# EAGLE design freBot_V2 (EAGLE 7.3.0)
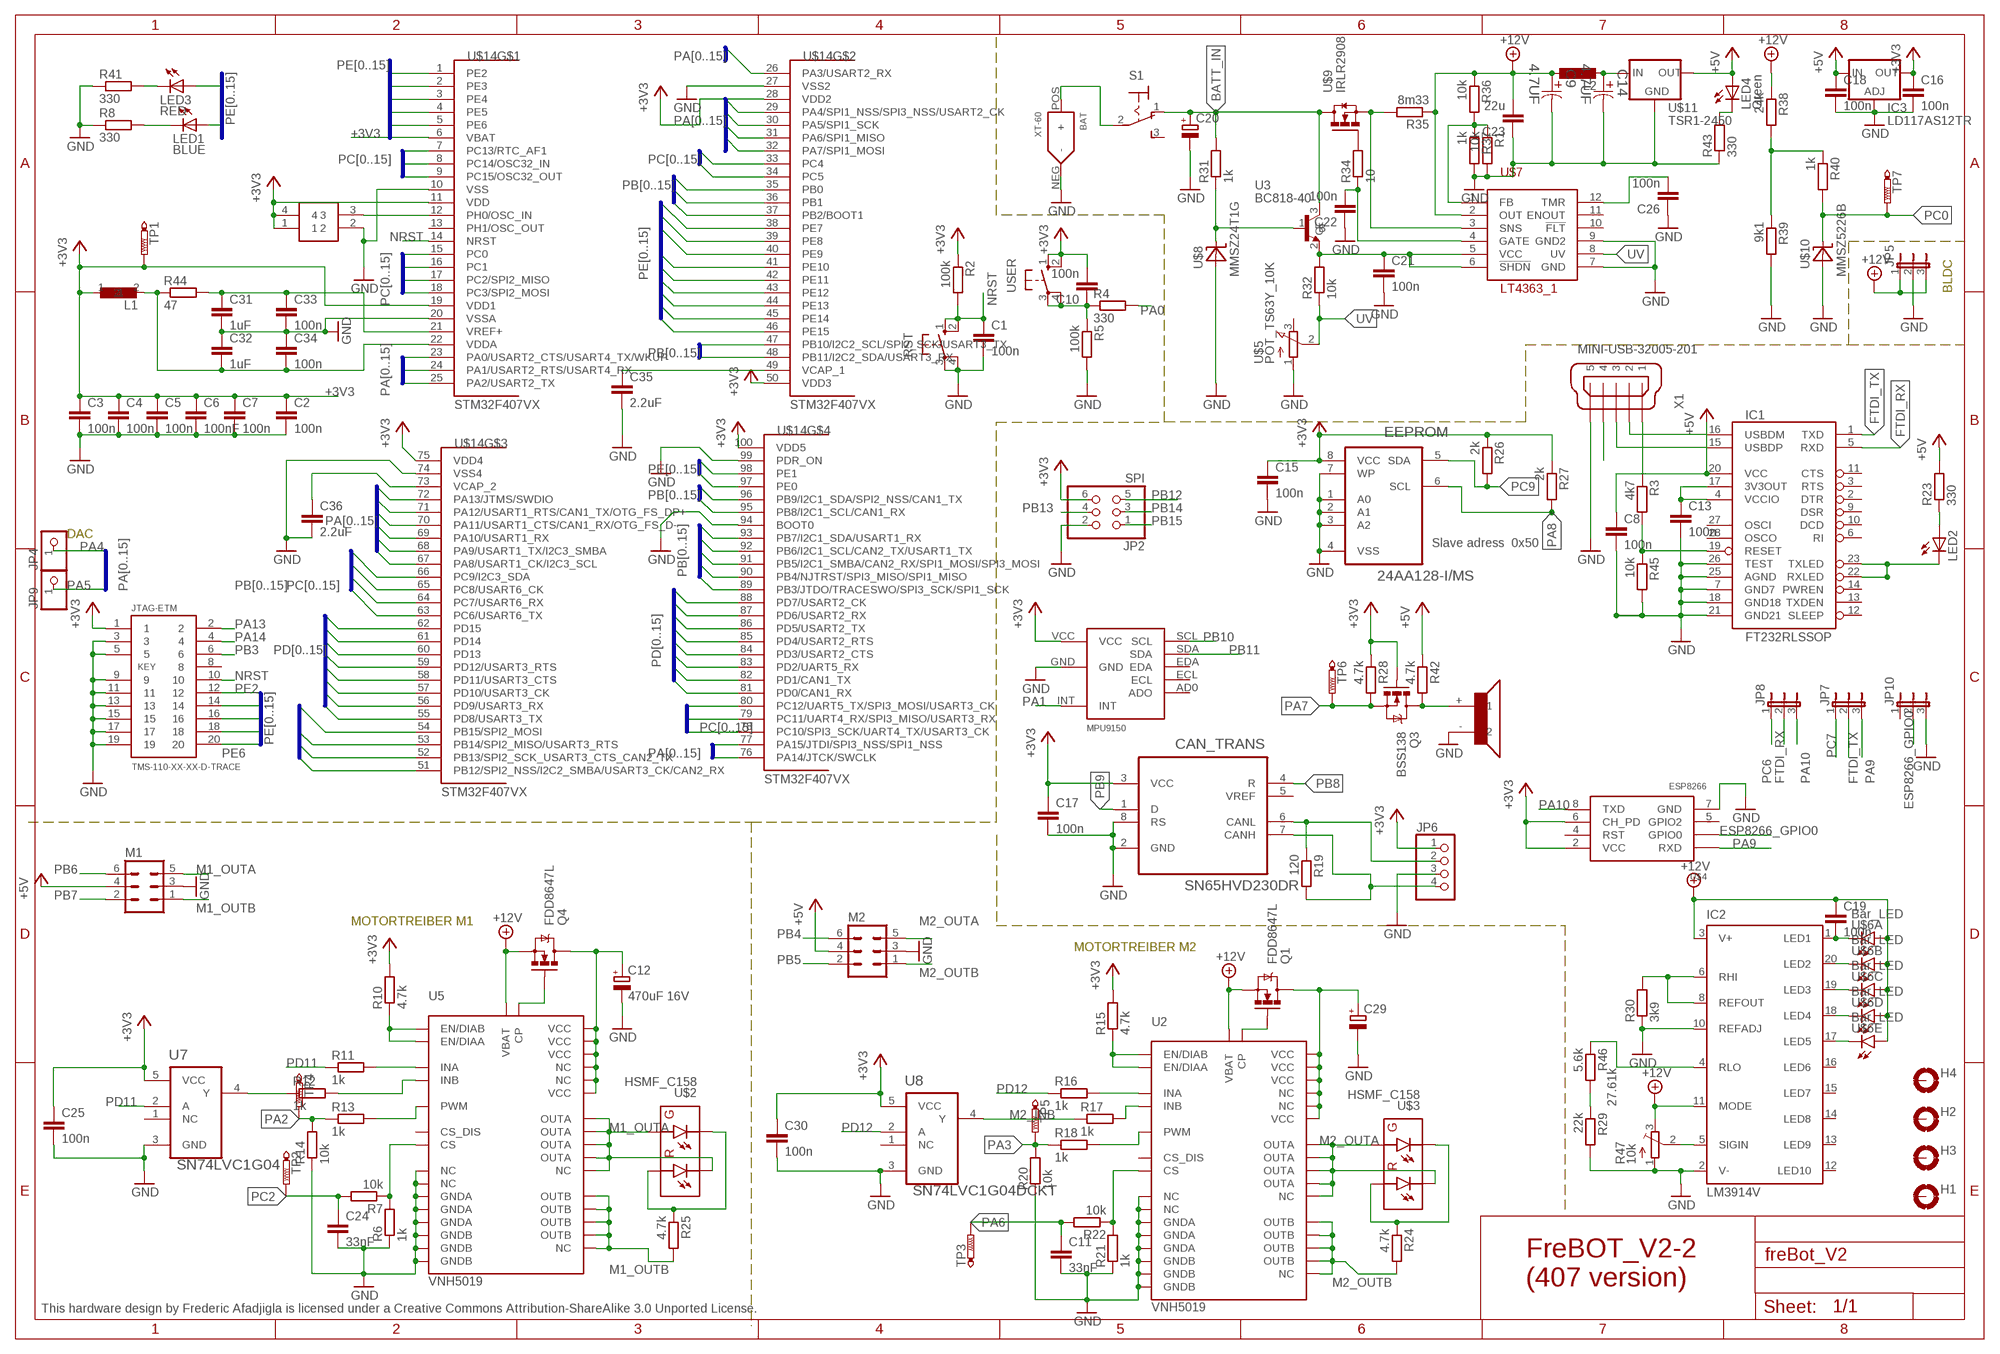
[diagram p0: schematic, sheet 1]

## Parts
BAT  XT-60  [XT-60]
C1  100n  C-EUC0603  [C0603]
C2  100n  C-EUC0603  [C0603]
C3  100n  C-EUC0603  [C0603]
C4  100n  C-EUC0603  [C0603]
C5  100n  C-EUC0603  [C0603]
C6  100nF  C-EUC0603  [C0603]
C7  100n  C-EUC0603  [C0603]
C8  100n  C-EUC0603  [C0603]
C9  4.7UF  EEE-1ES4R7SR-CASE-A  [CAPAE330X560N]
C10  100n  C-EUC0603  [C0603]
C11  33nF  C-EUC0805  [C0805]
C12  470uF 16V  CPOL-EU175TMP-0808  [175TMP-0808]
C13  100n  C-EUC0603  [C0603]
C14  4.7UF  EEE-1ES4R7SR-CASE-A  [CAPAE330X560N]
C15  100n  C-EUC0603  [C0603]
C16  100n  C-EUC0603  [C0603]
C17  100n  C-EUC0603  [C0603]
C18  100n  C-EUC0603  [C0603]
C19  100n  C-EUC0603  [C0603]
C20  CPOL-EU153CLV-0505  [153CLV-0505]
C21  100n  C-EUC0603  [C0603]
C22  100n  C-EUC0805  [C0805]
C23  22u  C-EUC0805  [C0805]
C24  33nF  C-EUC0805  [C0805]
C25  100n  C-EUC0603K  [C0603K]
C26  100n  C-EUC0805  [C0805]
C29  CPOL-EU175TMP-0808  [175TMP-0808]
C30  100n  C-EUC0603K  [C0603K]
C31  1uF  C-EUC0603  [C0603]
C32  1uF  C-EUC0603  [C0603]
C33  100n  C-EUC0603  [C0603]
C34  100n  C-EUC0603  [C0603]
C35  2.2uF  C-EUC0805  [C0805]
C36  2.2uF  C-EUC0805  [C0805]
CAN_TRANS  SN65HVD230DR  [SOIC127P600X175-8N]
EEPROM  24AA128-I/MS  [SOP65P490X110-8N]
H1  MOUNT-PAD-ROUND3.0  [3,0-PAD]
H2  MOUNT-PAD-ROUND3.0  [3,0-PAD]
H3  MOUNT-PAD-ROUND3.0  [3,0-PAD]
H4  MOUNT-PAD-ROUND3.0  [3,0-PAD]
IC1  FT232RLSSOP  [SSOP28DB]
IC2  LM3914V  [PLCC20S]
IC3  LD117AS12TR  [SOT223]
JP2  SPI  PINHD-2X3  [2X03]
JP4  PINHD-1X1  [1X01]
JP5  JP2E  [JP2]
JP6  PINHD-1X4  [1X04]
JP7  JP2E  [JP2]
JP8  JP2E  [JP2]
JP9  PINHD-1X1  [1X01]
JP10  JP2E  [JP2]
JTAG-ETM  TMS-110-XX-XX-D-TRACE  [TMS-110-XX-XX-D-TRACE]
L1  FERRITPERLE_0805  [FERRITPERLE_0805]
L2  L-EUWE-TPC  [POWER-CHOKE_WE-TPC]
LED1  BLUE  LEDCHIP-LED0805  [CHIP-LED0805]
LED2  LEDCHIP-LED0805  [CHIP-LED0805]
LED3  RED  LEDCHIP-LED0805  [CHIP-LED0805]
LED4  Green  LEDCHIP-LED0805  [CHIP-LED0805]
M1  ML6  [ML6]
M2  ML6  [ML6]
MPU9150  MPU9150_BREAKOUT  [MPU9150_BREAKOUT]
Q1  FDD8647L  MOSFET-NCHANNELFDD8580  [DPAK]
Q3  BSS138  MOSFET-NCHANNELBSS138  [SOT23-3]
Q4  FDD8647L  MOSFET-NCHANNELFDD8580  [DPAK]
R1  10k  R-EU_R0603  [R0603]
R2  100k  R-EU_R0603  [R0603]
R3  4k7  R-EU_R0603  [R0603]
R4  330  R-EU_R0603  [R0603]
R5  100k  R-EU_R0603  [R0603]
R6  1k  R-EU_R0603  [R0603]
R7  10k  R-EU_R0603  [R0603]
R8  330  R-EU_R0603  [R0603]
R10  4.7k  R-EU_R0603  [R0603]
R11  1k  R-EU_R0603  [R0603]
R12  1k  R-EU_R0603  [R0603]
R13  1k  R-EU_R0603  [R0603]
R14  10k  R-EU_R0603  [R0603]
R15  4.7k  R-EU_R0603  [R0603]
R16  1k  R-EU_R0603  [R0603]
R17  1k  R-EU_R0603  [R0603]
R18  1k  R-EU_R0603  [R0603]
R19  120  R-EU_R0603  [R0603]
R20  10k  R-EU_R0603  [R0603]
R21  1k  R-EU_R0603  [R0603]
R22  10k  R-EU_R0603  [R0603]
R23  330  R-EU_R0603  [R0603]
R24  4.7k  R-EU_R0603  [R0603]
R25  4.7k  R-EU_R0603  [R0603]
R26  2k  R-EU_R0603  [R0603]
R27  2k  R-EU_R0603  [R0603]
R28  4.7k  R-EU_R0603  [R0603]
R29  22k  R-EU_R0603  [R0603]
R30  3k9  R-EU_R0603  [R0603]
R31  1k  R-EU_R0603  [R0603]
R32  10k  R-EU_R0603  [R0603]
R34  10  R-EU_R0603  [R0603]
R35  8m33  R-EU_R2512  [R2512]
R36  10k  R-EU_R0603  [R0603]
R37  1k  R-EU_R0603  [R0603]
R38  24k  R-EU_R0603  [R0603]
R39  9k1  R-EU_R0603  [R0603]
R40  1k  R-EU_R0603  [R0603]
R41  330  R-EU_R0603  [R0603]
R42  4.7k  R-EU_R0603  [R0603]
R43  330  R-EU_R0603  [R0603]
R44  47  R-EU_R0603  [R0603]
R45  10k  R-EU_R0603  [R0603]
R46  5.6k  R-EU_R0603  [R0603]
R47  10k  TRIM_EU-SM-42/43A  [SM-42/43A]
RST  10-XX  [B3F-10XX]
S1  M9040P  [M9040P]
TP1  PTR1B1,27  [B1,27]
TP2  PTR1B1,27  [B1,27]
TP3  PTR1B1,27  [B1,27]
TP4  PTR1B1,27  [B1,27]
TP5  PTR1B1,27  [B1,27]
TP6  PTR1B1,27  [B1,27]
TP7  PTR1B1,27  [B1,27]
U2  VNH5019  [VNH5019]
U3  BC818-40  [SOT95P240X97-3N]
U5  VNH5019  [VNH5019]
U7  SN74LVC1G04  SN74LVC1G04DCKT  [SOT65P210X110-5N]
U8  SN74LVC1G04DCKT  [SOT65P210X110-5N]
U$1  CB3_OSCILLATOR  [CB3_OSCILLATOR]
U$2  HSMF_C158  [HSMF_C158]
U$3  HSMF_C158  [HSMF_C158]
U$4  ESP8266  [ESP8266]
U$5  POT_TS63Y_10K  [POT_TS63Y_10K]
U$6  Bar_LED  LED_BARGRAPH_5  [LED_BARGRAPH_5]
U$7  LT4363_1  [MSOP12]
U$8  MMSZ24T1G  [SOD123]
U$9  IRLR2908  [DPAK-TO252]
U$10  MMSZ5226B  MMSZ24T1G  [SOD123]
U$11  TSR1-2450  [TSR1-2450]
U$12  BUZZER  [BUZZER]
U$14  STM32F407VX  [LQFP100]
USER  10-XX  [B3F-10XX]
X1  MINI-USB-32005-201  [32005-201]

## Nets
+3V3: C2.1 C3.1 C4.1 C5.1 C6.1 C7.1 C10.2 C15.1 C16.1 C17.1 C25.1 C30.1 CAN_TRANS.3(VCC) EEPROM.8(VCC) IC3.4(OUT) JP2.6 JP6.1 JTAG-ETM.1 L1.1 MPU9150.VCC Q3.1(G) R2.1 R10.2 R15.2 R26.1 R27.1 R28.1 TP1.TP U7.5(VCC) U8.5(VCC) U$1.1 U$1.4 U$4.2(VCC) U$4.6(CH_PD) U$14.6(VBAT) U$14.11(VDD) U$14.19(VDD1) U$14.28(VDD2) U$14.50(VDD3) U$14.75(VDD4) U$14.100(VDD5) USER.1(S) USER.2(S1)
+5V: C8.1 C18.1 IC1.20(VCC) IC3.3(IN) LED4.A M1.4 M2.4 R23.2 R42.1 U$11.3(OUT)
+12V: C9.1 C19.1 C23.2 IC2.3(V+) IC2.11(MODE) JP5.1 JP5.3 L2.1 Q1.3(S) R35.1 R36.1 R38.1 R47.3(E) U2.12(VBAT) U5.12(VBAT) U$6.1(A:A) U$6.2(B:A) U$6.3(C:A) U$6.4(D:A) U$6.5(E:A) U$7.2(OUT)
BATT_IN: C20.+ R31.2 S1.1(O) U3.3(C) U$9.4(D)
ESP8266_GPIO0: JP10.2 U$4.3(GPIO0)
FTDI_RX: IC1.5(RXD) JP8.2
FTDI_TX: IC1.1(TXD) JP7.2
GND: BAT.NEG(-) C1.2 C2.2 C3.2 C4.2 C5.2 C6.2 C7.2 C8.2 C9.2 C11.2 C12.- C13.2 C14.2 C15.2 C16.2 C17.2 C18.2 C20.- C21.2 C22.1 C23.1 C24.2 C25.2 C26.1 C29.- C30.2 C31.2 C32.1 C33.2 C34.1 C35.2 C36.2 CAN_TRANS.2(GND) CAN_TRANS.8(RS) EEPROM.1(A0) EEPROM.2(A1) EEPROM.3(A2) EEPROM.4(VSS) EEPROM.7(WP) IC1.7(GND7) IC1.18(GND18) IC1.21(GND21) IC1.25(AGND) IC1.26(TEST) IC2.2(V-) IC2.10(REFADJ) IC3.1(ADJ) JP2.2 JP5.2 JP6.3 JP10.3 JTAG-ETM.3 JTAG-ETM.5 JTAG-ETM.9 JTAG-ETM.11 JTAG-ETM.13 JTAG-ETM.15 JTAG-ETM.17 JTAG-ETM.19 M1.3 M2.3 MPU9150.GND R1.2 R5.2 R6.1 R8.1 R14.1 R20.1 R21.1 R29.2 R30.1 R37.2 R39.2 R41.1 R43.1 R45.2 R47.1(A) RST.3(P) RST.4(P1) U2.17(NC) U2.18(GNDB) U2.19(GNDB) U2.20(GNDB) U2.26(GNDA) U2.27(GNDA) U2.28(GNDA) U2.29(NC) U5.17(NC) U5.18(GNDB) U5.19(GNDB) U5.20(GNDB) U5.26(GNDA) U5.27(GNDA) U5.28(GNDA) U5.29(NC) U7.3(GND) U8.3(GND) U$1.2 U$4.7(GND) U$5.1(A) U$7.7(GND) U$7.9(GND2) U$8.A U$10.A U$11.2(GND) U$12.- U$14.10(VSS) U$14.20(VSSA) U$14.27(VSS2) U$14.74(VSS4) U$14.94(BOOT0) U$14.99(PDR_ON) X1.5
M1_INB: R12.1 U7.4(Y)
M1_OUTA: M1.5 U5.1(OUTA) U5.24(NC) U5.25(OUTA) U5.30(OUTA) U5.SLUG2(OUTA) U$2.GA U$2.RC
M1_OUTB: M1.1 R25.2 U5.15(OUTB) U5.16(OUTB) U5.21(OUTB) U5.22(NC) U5.SLUG3(OUTB)
M2_INB: R17.1 U8.4(Y)
M2_OUTA: M2.5 U2.1(OUTA) U2.24(NC) U2.25(OUTA) U2.30(OUTA) U2.SLUG2(OUTA) U$3.GA U$3.RC
M2_OUTB: M2.1 R24.2 U2.15(OUTB) U2.16(OUTB) U2.21(OUTB) U2.22(NC) U2.SLUG3(OUTB)
N$1: R12.2 U5.10(INB)
N$2: C31.1 C33.1 R44.2 U$14.21(VREF+)
N$3: U$1.3 U$14.12(PH0/OSC_IN)
N$4: X1.4
N$5: IC1.19(RESET) R3.2 R45.1
N$6: R6.2 R7.1 U5.8(CS)
N$7: C29.+ Q1.4(D) U2.2(NC) U2.3(VCC) U2.13(VCC) U2.14(NC) U2.23(VCC) U2.SLUG1(VCC)
N$8: R15.1 U2.5(EN/DIAA) U2.9(EN/DIAB)
N$9: R10.1 U5.5(EN/DIAA) U5.9(EN/DIAB)
N$10: R11.2 U5.4(INA)
N$11: C12.+ Q4.4(D) U5.2(NC) U5.3(VCC) U5.13(VCC) U5.14(NC) U5.23(VCC) U5.SLUG1(VCC)
N$12: R16.2 U2.4(INA)
N$13: Q4.1(G) U5.11(CP)
N$14: R13.2 U5.7(PWM)
N$15: R18.2 U2.7(PWM)
N$16: R17.2 U2.10(INB)
N$17: IC2.4(RLO) R46.1
N$18: CAN_TRANS.6(CANL) JP6.2 R19.1
N$19: R21.2 R22.1 U2.8(CS)
N$20: R29.1 R46.2
N$22: C13.1 IC1.4(VCCIO) IC1.17(3V3OUT)
N$23: C14.1 L2.2 U$11.1(IN)
N$24: Q1.1(G) U2.11(CP)
N$25: LED1.C R8.2
N$26: IC1.22(RXLED) IC1.23(TXLED) LED2.C
N$28: IC1.15(USBDP) X1.3
N$30: BAT.POS(+) S1.2(P)
N$31: LED2.A R23.1
N$32: R24.1 U$3.GC U$3.RA
N$34: Q3.3(D) R42.2 U$12.+
N$35: IC2.5(SIGIN) R47.2(S)
N$36: C10.1 R4.1 R5.1 USER.3(P) USER.4(P1)
N$37: LED3.C R41.2
N$38: R25.1 U$2.GC U$2.RA
N$40: C19.2 IC2.1(LED1) U$6.10(A:C)
N$41: IC2.6(RHI) IC2.8(REFOUT) R30.2
N$42: IC2.20(LED2) U$6.9(B:C)
N$43: IC2.19(LED3) U$6.8(C:C)
N$44: IC2.18(LED4) U$6.7(D:C)
N$45: IC2.17(LED5) U$6.6(E:C)
N$46: R31.1 U3.1(B) U$8.C
N$47: R34.2 U$9.1(G)
N$48: C21.1 R32.2 U3.2(E) U$7.5(VCC) U$7.6(!SHDN)
N$49: C22.2 R34.1 U$7.4(GATE)
N$50: R35.2 U$7.3(SNS) U$9.3(S)
N$51: C26.2 U$7.12(TMR)
N$52: R1.1 R36.2 R37.1 U$7.1(FB)
N$53: C32.2 C34.2 L1.2 R44.1 U$14.22(VDDA)
N$54: R38.2 R39.1 R40.1
N$58: LED4.C R43.2
N$59: C35.1 U$14.49(VCAP_1)
N$61: CAN_TRANS.7(CANH) JP6.4 R19.2
N$64: IC1.16(USBDM) X1.2
N$66: C36.1 U$14.73(VCAP_2)
NRST: C1.1 JTAG-ETM.10 R2.2 RST.1(S) RST.2(S1) U$14.14(NRST)
PA0: R4.2 U$14.23(PA0/USART2_CTS/USART4_TX/WKUP)
PA1: MPU9150.INT U$14.24(PA1/USART2_RTS/USART4_RX)
PA2: R13.1 R14.2 TP4.TP U$14.25(PA2/USART2_TX)
PA3: R18.1 R20.2 TP5.TP U$14.26(PA3/USART2_RX)
PA4: JP4.1 U$14.29(PA4/SPI1_NSS/SPI3_NSS/USART2_CK)
PA5: JP9.1 U$14.30(PA5/SPI1_SCK)
PA6: C11.1 R22.2 TP3.TP U$14.31(PA6/SPI1_MISO)
PA7: Q3.2(S) R28.2 TP6.TP U$14.32(PA7/SPI1_MOSI)
PA8: EEPROM.6(SCL) R27.2 U$14.67(PA8/USART1_CK/I2C3_SCL)
PA9: JP7.3 U$4.1(RXD) U$14.68(PA9/USART1_TX/I2C3_SMBA)
PA10: JP8.3 U$4.8(TXD) U$14.69(PA10/USART1_RX)
PA11: U$14.70(PA11/USART1_CTS/CAN1_RX/OTG_FS_D-)
PA12: U$14.71(PA12/USART1_RTS/CAN1_TX/OTG_FS_DP+)
PA13: JTAG-ETM.2 U$14.72(PA13/JTMS/SWDIO)
PA14: JTAG-ETM.4 U$14.76(PA14/JTCK/SWCLK)
PA15: U$14.77(PA15/JTDI/SPI3_NSS/SPI1_NSS)
PB0: U$14.35(PB0)
PB1: U$14.36(PB1)
PB2: U$14.37(PB2/BOOT1)
PB3: JTAG-ETM.6 U$14.89(PB3/JTDO/TRACESWO/SPI3_SCK/SPI1_SCK)
PB4: M2.6 U$14.90(PB4/NJTRST/SPI3_MISO/SPI1_MISO)
PB5: M2.2 U$14.91(PB5/I2C1_SMBA/CAN2_RX/SPI1_MOSI/SPI3_MOSI)
PB6: M1.6 U$14.92(PB6/I2C1_SCL/CAN2_TX/USART1_TX)
PB7: M1.2 U$14.93(PB7/I2C1_SDA/USART1_RX)
PB8: CAN_TRANS.4(R) U$14.95(PB8/I2C1_SCL/CAN1_RX)
PB9: CAN_TRANS.1(D) U$14.96(PB9/I2C1_SDA/SPI2_NSS/CAN1_TX)
PB10: MPU9150.SCL U$14.47(PB10/I2C2_SCL/SPI2_SCK/USART3_TX)
PB11: MPU9150.SDA U$14.48(PB11/I2C2_SDA/USART3_RX)
PB12: JP2.5 U$14.51(PB12/SPI2_NSS/I2C2_SMBA/USART3_CK/CAN2_RX)
PB13: JP2.4 U$14.52(PB13/SPI2_SCK_USART3_CTS_CAN2_TX)
PB14: JP2.3 U$14.53(PB14/SPI2_MISO/USART3_RTS)
PB15: JP2.1 U$14.54(PB15/SPI2_MOSI)
PC0: R40.2 TP7.TP U$10.C U$14.15(PC0)
PC1: U$14.16(PC1)
PC2: C24.1 R7.2 TP2.TP U$14.17(PC2/SPI2_MISO)
PC3: U$14.18(PC3/SPI2_MOSI)
PC4: U$14.33(PC4)
PC5: U$14.34(PC5)
PC6: JP8.1 U$14.63(PC6/USART6_TX)
PC7: JP7.1 U$14.64(PC7/USART6_RX)
PC8: U$14.65(PC8/USART6_CK)
PC9: EEPROM.5(SDA) R26.2 U$14.66(PC9/I2C3_SDA)
PC10: U$14.78(PC10/SPI3_SCK/UART4_TX/USART3_CK)
PC11: U$14.79(PC11/UART4_RX/SPI3_MISO/USART3_RX)
PC12: U$14.80(PC12/UART5_TX/SPI3_MOSI/USART3_CK)
PC13: U$14.7(PC13/RTC_AF1)
PC14: U$14.8(PC14/OSC32_IN)
PC15: U$14.9(PC15/OSC32_OUT)
PD0: U$14.81(PD0/CAN1_RX)
PD1: U$14.82(PD1/CAN1_TX)
PD2: U$14.83(PD2/UART5_RX)
PD3: U$14.84(PD3/USART2_CTS)
PD4: U$14.85(PD4/USART2_RTS)
PD5: U$14.86(PD5/USART2_TX)
PD6: U$14.87(PD6/USART2_RX)
PD7: U$14.88(PD7/USART2_CK)
PD8: U$14.55(PD8/USART3_TX)
PD9: U$14.56(PD9/USART3_RX)
PD10: U$14.57(PD10/USART3_CK)
PD11: R11.1 U7.2(A) U$14.58(PD11/USART3_CTS)
PD12: R16.1 U8.2(A) U$14.59(PD12/USART3_RTS)
PD13: U$14.60(PD13)
PD14: U$14.61(PD14)
PD15: U$14.62(PD15)
PE0: LED3.A U$14.97(PE0)
PE1: LED1.A U$14.98(PE1)
PE2: JTAG-ETM.12 U$14.1(PE2)
PE3: JTAG-ETM.14 U$14.2(PE3)
PE4: JTAG-ETM.16 U$14.3(PE4)
PE5: JTAG-ETM.18 U$14.4(PE5)
PE6: JTAG-ETM.20 U$14.5(PE6)
PE7: U$14.38(PE7)
PE8: U$14.39(PE8)
PE9: U$14.40(PE9)
PE10: U$14.41(PE10)
PE11: U$14.42(PE11)
PE12: U$14.43(PE12)
PE13: U$14.44(PE13)
PE14: U$14.45(PE14)
PE15: U$14.46(PE15)
USB_5V: R3.1 X1.1
UV: R32.1 U$5.2(S) U$7.8(UV)
Unconnected: CAN_TRANS.5(VREF) H1.B3,0(MOUNT) H2.B3,0(MOUNT) H3.B3,0(MOUNT) H4.B3,0(MOUNT) IC1.2(DTR) IC1.3(RTS) IC1.6(RI) IC1.9(DSR) IC1.10(DCD) IC1.11(CTS) IC1.12(SLEEP) IC1.13(TXDEN) IC1.14(PWREN) IC1.27(OSCI) IC1.28(OSCO) IC2.12(LED10) IC2.13(LED9) IC2.14(LED8) IC2.15(LED7) IC2.16(LED6) JP10.1 JTAG-ETM.8 MPU9150.AD0(ADO) MPU9150.ECL MPU9150.EDA Q4.3(S) S1.3(S) U2.6(CS_DIS) U5.6(CS_DIS) U7.1(NC) U8.1(NC) U$4.4(RST) U$4.5(GPIO2) U$5.3(E) U$7.10(!FLT) U$7.11(ENOUT) U$14.13(PH1/OSC_OUT)

## Buses
PE[0..15]
PA[0..15]
PC[0..15]
PD[0..15]
PB[0..15]

## Notes on the sheet
- BLDC
- DAC | Slave adress  0x50
- FTDI
- FTDI
- MOTORTREIBER M1
- MOTORTREIBER M2
- 27.61k
- FreBOT_V2-2
  (407 version)
- This hardware design by Frederic Afadjigla is licensed under a Creative Commons Attribution-ShareAlike 3.0 Unported License.

## Library data of the parts
BAT = freBotLib:XT-60
C1-C8 C10 C11 C13 C15-C19 C21-C26 C30-C36 = rcl:C-EU: CAPACITOR, European symbol
C9 C14 = Panasonic-EEE0_EEE1_EEE2_EEEFC:EEE-: Aluminum Electrolytic Capacitors,Surface Mount Type; MPN: EEE-1ES4R7SR; OC_FARNELL: 2284806; OC_NEWARK: 53W3806; PACKAGE: CASE-A; SUPPLIER: PANASONIC; TOLERANCE: 20%; VOLTAGERATING: 25V
C12 C20 C29 = rcl:CPOL-EU: POLARIZED CAPACITOR, European symbol
CAN_TRANS = SN65HVD230D:SN65HVD230DR: 3.3-V CAN TRANSCEIVERS; MPN: SN65HVD230DR; OC_FARNELL: 8452148; OC_NEWARK: 75C7745; PACKAGE: SOIC-8; SUPPLIER: Texas Instruments
EEPROM = freBotLib:24AA128-I/MS
H1-H4 = holes:MOUNT-PAD-ROUND: MOUNTING PAD, round
IC1 = SparkFun:FT232RL: USB UART FT232RL 4th Generation USB UART (USB <-> Serial) Controller. Spark Fun Electronics SKU : COM-00650
IC2 = national-semiconductor:LM391: Dot/Bar Display Driver Source: Data sheet LM3915 <http://www.national.com/ds/LM/LM3915.pdf> Data sheet LM3914 <http://www.national.com/ds/LM/LM3914.pdf>
IC3 = v-reg:LD117A?*: Low drop fixed and adjustable positive voltage regulators 1 A Source: http://www.st.com/stonline/products/literature/ds/7194/ld1117axx.pdf
JP2 = pinhead:PINHD-2X3: PIN HEADER
JP4 JP9 = pinhead:PINHD-1X1: PIN HEADER
JP5 JP7 JP8 JP10 = jumper:JP2E: JUMPER
JP6 = pinhead:PINHD-1X4: PIN HEADER
JTAG-ETM = TMS110XXXXDplusTraceJTAG:TMS-110-XX-XX-D-TRACE
L1 = Ferritperle_0805:FERRITPERLE_0805
L2 = rcl:L-EU: INDUCTOR, European symbol
LED1-LED4 = led:LED: LED OSRAM: - CHIPLED LG R971, LG N971, LY N971, LG Q971, LY Q971, LO R971, LY R971 LH N974, LH R974 LS Q976, LO Q976, LY Q976 LO Q996 - Hyper CHIPLED LW Q18S LB Q993, LB Q99A, LB R99A - SideLED LS A670, LO A670, LY A670, LG A670, LP A670 LB A673, LV A673, LT A673, LW A673 LH A674 LY A675 LS A676, LA A676, LO A676, LY A676, LW A676 LS A679, LY A679, LG A679 - Hyper Micro SIDELED® LS Y876, LA Y876, LO Y876, LY Y876 LT Y87S - SmartLED LW L88C, LW L88S LB L89C, LB L89S, LG L890 LS L89K, LO L89K, LY L89K LS L896, LA L896, LO L896, LY L896 - TOPLED LS T670, LO T670, LY T670, LG T670, LP T670 LSG T670, LSP T670, LSY T670, LOP T670, LYG T670 LG T671, LOG T671, LSG T671 LB T673, LV T673, LT T673, LW T673 LH T674 LS T676, LA T676, LO T676, LY T676, LB T676, LH T676, LSB T676, LW T676 LB T67C, LV T67C, LT T67C, LS T67K, LO T67K, LY T67K, LW E67C LS E67B, LA E67B, LO E67B, LY E67B, LB E67C, LV E67C, LT E67C LW T67C LS T679, LY T679, LG T679 LS T770, LO T770, LY T770, LG T770, LP T770 LB T773, LV T773, LT T773, LW T773 LH T774 LS E675, LA E675, LY E675, LS T675 LS T776, LA T776, LO T776, LY T776, LB T776 LHGB T686 LT T68C, LB T68C - Hyper Mini TOPLED® LB M676 - Mini TOPLED Santana® LG M470 LS M47K, LO M47K, LY M47K Source: http://www.osram.convergy.de LUXEON: - LUMILED® LXK2-PW12-R00, LXK2-PW12-S00, LXK2-PW14-U00, LXK2-PW14-V00 LXK2-PM12-R00, LXK2-PM12-S00, LXK2-PM14-U00 LXK2-PE12-Q00, LXK2-PE12-R00, LXK2-PE12-S00, LXK2-PE14-T00, LXK2-PE14-U00 LXK2-PB12-K00, LXK2-PB12-L00, LXK2-PB12-M00, LXK2-PB14-N00, LXK2-PB14-P00, LXK2-PB14-Q00 LXK2-PR12-L00, LXK2-PR12-M00, LXK2-PR14-Q00, LXK2-PR14-R00 LXK2-PD12-Q00, LXK2-PD12-R00, LXK2-PD12-S00 LXK2-PH12-R00, LXK2-PH12-S00 LXK2-PL12-P00, LXK2-PL12-Q00, LXK2-PL12-R00 Source: www.luxeon.com KINGBRIGHT: KA-3528ASYC Source: www.kingbright.com
M1 M2 = con-harting-ml:ML6: HARTING; OC_FARNELL: unknown; OC_NEWARK: unknown
MPU9150 = freBotLib:MPU9150_BREAKOUT
Q1 Q4 = SparkFun:MOSFET-NCHANNEL
Q3 = SparkFun-DiscreteSemi:MOSFET-NCHANNEL: Common NMOSFET Parts MFG P/N Store ID Prod ID FDD8780 TRANS-09984 SI7820DN TRANS-11055 FDS6630A IC-08089 2N7002PW TRANS-11151 FQP30N06L COM-10213 TRANS-10060 BSS123LT1G TRANS-08345 BSS138 TRANS-00830 BS170 2N7000; PROD_ID: TRANS-00830; VALUE: 200mA/50V
R1-R8 R10-R32 R34-R46 = rcl:R-EU_: RESISTOR, European symbol
R47 = pot:TRIM_EU-: POTENTIOMETER
RST USER = switch-omron:10-XX: OMRON SWITCH; MPN: B3F-1000; OC_FARNELL: 176432; OC_NEWARK: 36M3542
S1 = switch:M9040P: TOGGLE SWITCH Marquardt
TP1-TP7 = testpad:PTR1: TEST PIN
U2 U5 = SparkFun:VNH5019
U3 = freBotLib:BC818-40: NPN Epitaxial Silicon Transistor; MPN: BC818-40; OC_FARNELL: 9846662; OC_NEWARK: 96K6864; PACKAGE: SOT-3; SUPPLIER: Fairchild
U7 U8 = freBotLib:SN74LVC1G04DCKT: SINGLE INVERTER GATE; MPN: SN74LVC1G04DCKT; OC_FARNELL: 1470831; OC_NEWARK: 22H0375; PACKAGE: SC-70-5; SUPPLIER: Texas Instruments
U$1 = CB3_oscillator:CB3_OSCILLATOR
U$2 U$3 = freBotLib:HSMF_C158
U$4 = freBotLib:ESP8266
U$5 = FSEWeatherShield:POT_TS63Y_10K
U$6 = freBotLib:LED_BARGRAPH_5
U$7 = freBotLib:LT4363_1
U$8 U$10 = freBotLib:MMSZ24T1G
U$9 = freBotLib:IRLR2908
U$11 = freBotLib:TSR1-2450
U$12 = freBotLib:BUZZER
U$14 = STM32F407VxLQFP100:STM32F407VX: STmicroelectronics Cortex M4 Series Typ: STM32F407Vx LQFP100
X1 = con-cypressindustries:MINI-USB-: MINI USB-B Conector Source: www.cypressindustries.com; OC_FARNELL: unknown; OC_NEWARK: unknown

## Board
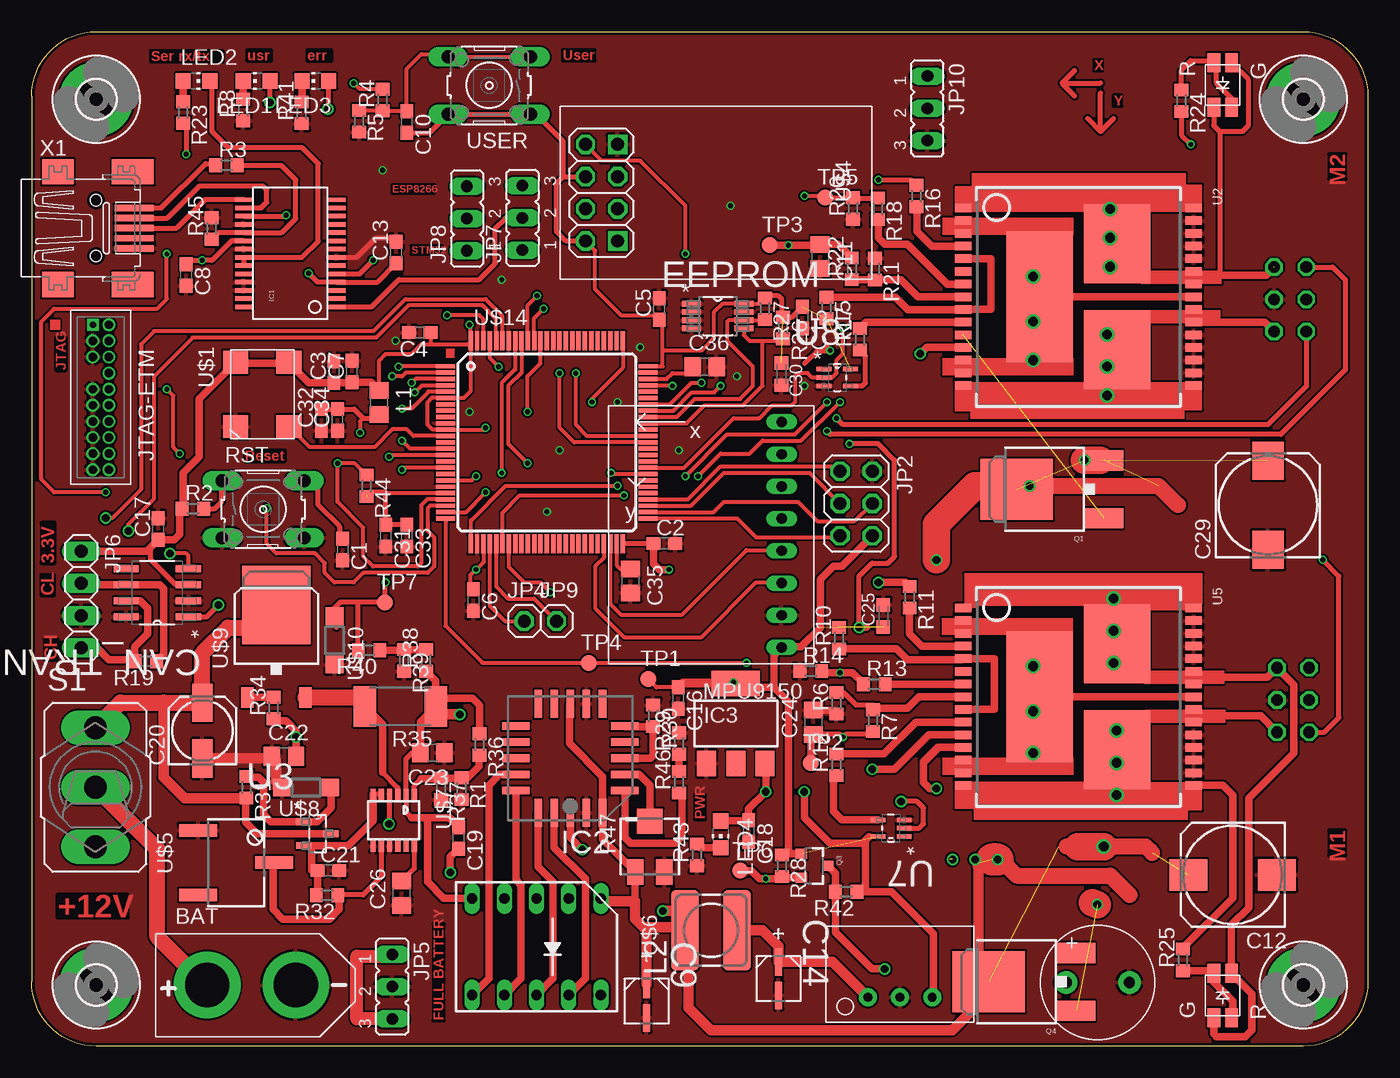
[diagram p1: board, top side]
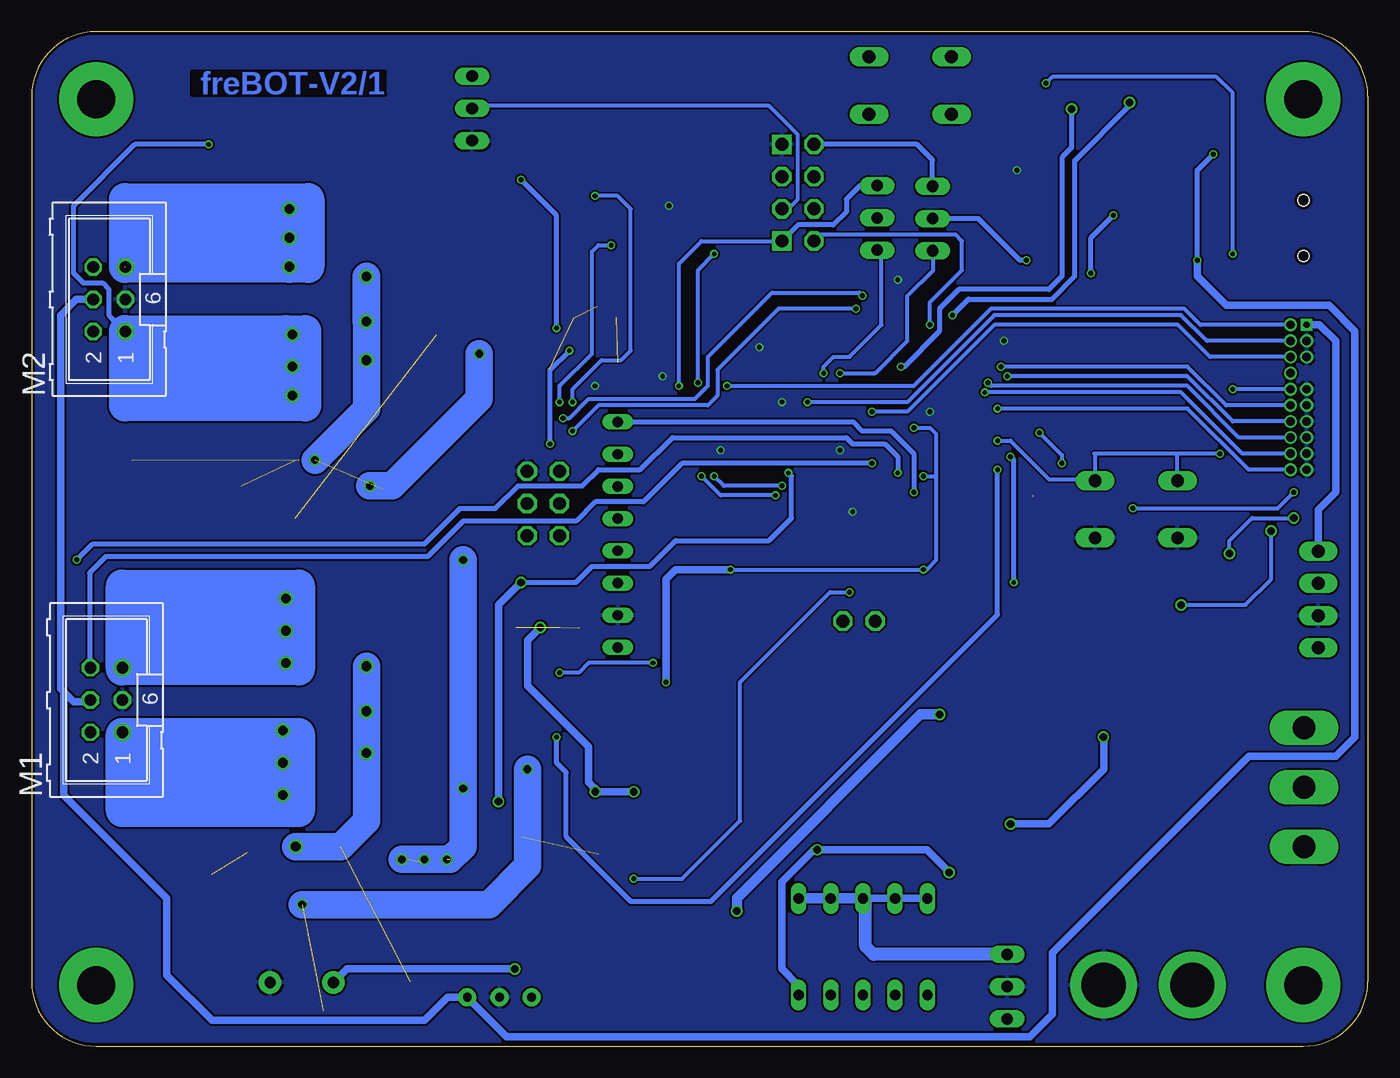
[diagram p2: board, bottom side, seen from below]

Size 105.41 x 80.01 mm. Coordinates in mm from the lower left corner, seen from the top.
Outline: 5.08,80.01 100.33,80.01 arc-90 105.41,74.93 105.41,5.08 arc-90 100.33,0 5.08,0 arc-90 0,5.08 0,74.93 arc-90 5.08,80.01
Copper layers (1*16): Top 0.018mm / dielectric 1.55mm / Bottom 0.018mm
Design rules "eC_2Layer_PClass6_BaseCopperO18_eCDefault": minimum track width 0.15mm, minimum drill 0.35mm, track to track 0.15mm, track to pad 0.15mm, pad to pad 0.15mm, via to via 0.15mm, smd to smd 0mil, copper to edge 0.25mm, drill to drill 0.35mm, minimum pad ring 0.175mm, minimum via ring 0.125mm, stop-mask expansion 0mil, vias tented up to drill 0.45mm, thermal gap 0.2mm

### Footprints (pad centres in the part's own frame; a part is rotated, then mirrored left to right if it is on the bottom)
XT-60 = drill 3.5: NEG 3.19,0; POS -3.81,0
C0603 = smd 1.1 x 1: 1 -0.85,0; 2 0.85,0
CAPAE330X560N = smd 2.159 x 0.559: 1 -1.321,0; 2 1.321,0
C0805 = smd 1.3 x 1.5: 1 -0.95,0; 2 0.95,0
175TMP-0808 = smd 3 x 2.5: + 3.5,0; - -3.5,0
153CLV-0505 = smd 3 x 1.6: + 2.2,0; - -2.2,0
C0603K = smd 1.05 x 1.08: 1 -0.875,0; 2 0.875,0
SOIC127P600X175-8N = smd 1.981 x 0.559: 1 -2.464,1.905; 2 -2.464,0.635; 3 -2.464,-0.635; 4 -2.464,-1.905; 5 2.464,-1.905; 6 2.464,-0.635; 7 2.464,0.635; 8 2.464,1.905
SOP65P490X110-8N = smd 1.499 x 0.457: 1 -2.057,0.965; 2 -2.057,0.33; 3 -2.057,-0.33; 4 -2.057,-0.965; 5 2.057,-0.965; 6 2.057,-0.33; 7 2.057,0.33; 8 2.057,0.965
3,0-PAD = drill 3 pad 5.842: B3,0 0,0
SSOP28DB = smd 0.348 x 1.397: 1 -4.225,-3.656; 2 -3.575,-3.656; 3 -2.925,-3.656; 4 -2.275,-3.656; 5 -1.625,-3.656; 6 -0.975,-3.656; 7 -0.325,-3.656; 8 0.325,-3.656; 9 0.975,-3.656; 10 1.625,-3.656; 11 2.275,-3.656; 12 2.925,-3.656; 13 3.575,-3.656; 14 4.225,-3.656; 15 4.225,3.656; 16 3.575,3.656; 17 2.925,3.656; 18 2.275,3.656; 19 1.625,3.656; 20 0.975,3.656; 21 0.325,3.656; 22 -0.325,3.656; 23 -0.975,3.656; 24 -1.625,3.656; 25 -2.275,3.656; 26 -2.925,3.656; 27 -3.575,3.656; 28 -4.225,3.656
PLCC20S = smd 0.6 x 2.2: 1 0,4.3; 2 -1.27,4.3; 3 -2.54,4.3; 9 -2.54,-4.3; 10 -1.27,-4.3; 11 0,-4.3; 12 1.27,-4.3; 13 2.54,-4.3; 19 2.54,4.3; 20 1.27,4.3 | smd 2.2 x 0.6: 4 -4.3,2.54; 5 -4.3,1.27; 6 -4.3,0; 7 -4.3,-1.27; 8 -4.3,-2.54; 14 4.3,-2.54; 15 4.3,-1.27; 16 4.3,0; 17 4.3,1.27; 18 4.3,2.54
SOT223 = smd 1.5 x 2: 1 -2.3,-3.15; 2 0,-3.15; 3 2.3,-3.15 | smd 3.8 x 2: 4 0,3.15
2X03 = drill 1.016 octagon: 1 -2.54,-1.27; 2 -2.54,1.27; 3 0,-1.27; 4 0,1.27; 5 2.54,-1.27; 6 2.54,1.27
1X01 = drill 1.016 octagon: 1 0,0
JP2 = drill 0.914 long: 1 -2.54,0; 2 0,0; 3 2.54,0
1X04 = drill 1.016 long: 1 -3.81,0; 2 -1.27,0; 3 1.27,0; 4 3.81,0
TMS-110-XX-XX-D-TRACE = drill 0.5 pad 0.914 square: 1 -5.715,0 | drill 0.66 pad 0.813: 2 -5.715,1.27 | drill 0.66 pad 0.914: 3 -4.445,0; 4 -4.445,1.27; 5 -3.175,0; 6 -3.175,1.27; 8 -1.905,1.27; 9 -0.635,0; 10 -0.635,1.27; 11 0.635,0; 12 0.635,1.27; 13 1.905,0; 14 1.905,1.27; 15 3.175,0; 16 3.175,1.27; 17 4.445,0; 18 4.445,1.27; 19 5.715,0; 20 5.715,1.27
FERRITPERLE_0805 = smd 1.3 x 1.5: 1 -0.95,0; 2 0.95,0
POWER-CHOKE_WE-TPC = smd 6.3 x 2.2: 1 0,2.05; 2 0,-2.05
CHIP-LED0805 = smd 1.2 x 1.2: A 0,-1.05; C 0,1.05
ML6 = drill 0.914 octagon: 1 -2.54,-1.27; 2 -2.54,1.27; 3 0,-1.27; 4 0,1.27; 5 2.54,-1.27; 6 2.54,1.27
MPU9150_BREAKOUT = drill 0.813 long: AD0 2.54,3.81; ECL 2.54,6.35; EDA 2.54,8.89; GND 2.54,16.51; INT 2.54,1.27; SCL 2.54,13.97; SDA 2.54,11.43; VCC 2.54,19.05
DPAK = smd 1.6 x 3: 1 -2.28,-5.31; 3 2.28,-5.31 | smd 4.826 x 5.715: 4 0,1.588
SOT23-3 = smd 0.8 x 0.9: 1 -0.95,-1; 2 0.95,-1; 3 0,1.1
R0603 = smd 1 x 1.1: 1 -0.85,0; 2 0.85,0
R2512 = smd 1.8 x 3.2: 1 -2.8,0; 2 2.8,0
SM-42/43A = smd 2 x 1.3: 1 2,1.15; 3 2,-1.15 | smd 2 x 2: 2 -2,0
B3F-10XX = drill 1.016 long: 1 -3.251,2.261; 2 3.251,2.261; 3 -3.251,-2.261; 4 3.251,-2.261
M9040P = drill 1.803 long: 1 0,4.699; 2 0,0; 3 0,-4.699
B1,27 = smd 1.27 x 1.27: TP 0,0
VNH5019 = smd 0.67 x 1.3: 1 -7,-9.1; 2 -6,-9.1; 3 -5,-9.1; 4 -4,-9.1; 5 -3,-9.1; 6 -2,-9.1; 7 -1,-9.1; 8 0,-9.1; 9 1,-9.1; 10 2,-9.1; 11 3,-9.1; 12 4,-9.1; 13 5,-9.1; 14 6,-9.1; 15 7,-9.1; 16 7,9.1; 17 6,9.1; 18 5,9.1; 19 4,9.1; 20 3,9.1; 21 2,9.1; 22 1,9.1; 23 0,9.1; 24 -1,9.1; 25 -2,9.1; 26 -3,9.1; 27 -4,9.1; 28 -5,9.1; 29 -6,9.1; 30 -7,9.1 | smd 10.3 x 5.25: SLUG1 0,-3.05 | smd 6.23 x 5.25: SLUG2 -4.165,3.05; SLUG3 4.165,3.05
SOT95P240X97-3N = smd 1.219 x 0.533: 1 -1.067,0.94; 2 -1.067,-0.94; 3 1.067,0
SOT65P210X110-5N = smd 1.168 x 0.356: 1 -1.041,0.66; 2 -1.041,0; 3 -1.041,-0.66; 4 1.041,-0.66; 5 1.041,0.66
CB3_OSCILLATOR = smd 1.8 x 2: 1 -2.54,-2.1; 2 2.54,-2.1; 3 2.54,2.1; 4 -2.54,2.1
HSMF_C158 = smd 1.5 x 1: GA -1.75,0.7; GC 1.75,0.7; RA -1.75,-0.7; RC 1.75,-0.7
ESP8266 = drill 1.016 square: 1 -1.27,3.81; 7 -1.27,-3.81 | drill 1.016 octagon: 2 1.27,3.81; 3 -1.27,1.27; 4 1.27,1.27; 5 -1.27,-1.27; 6 1.27,-1.27; 8 1.27,-3.81
POT_TS63Y_10K = smd 3 x 1: 1 3,-2.54; 2 -3,0; 3 3,2.54
LED_BARGRAPH_5 = drill 0.813 long: 1 -3.81,-3.81; 2 -1.27,-3.81; 3 1.27,-3.81; 4 3.81,-3.81; 5 6.35,-3.81; 6 6.35,3.81; 7 3.81,3.81; 8 1.27,3.81; 9 -1.27,3.81; 10 -3.81,3.81
MSOP12 = smd 0.889 x 0.42: 1 -2.045,1.637; 2 -2.045,0.987; 3 -2.045,0.337; 4 -2.045,-0.314; 5 -2.045,-0.964; 6 -2.045,-1.613; 7 2.045,-1.613; 8 2.045,-0.964; 9 2.045,-0.314; 10 2.045,0.337; 11 2.045,0.987; 12 2.045,1.637
SOD123 = smd 1.4 x 1.4: A 1.9,0; C -1.9,0
DPAK-TO252 = smd 1 x 1.6: 1 -2.28,-6.07; 3 2.28,-6.07 | smd 5.4 x 6.2: 4 0,1.23
TSR1-2450 = drill 0.7 pad 1.422: 1 3.05,2.02; 2 5.59,2.02; 3 8.13,2.02
BUZZER = drill 0.9 pad 1.778: + -2.5,0; - 2.5,0
LQFP100 = smd 1.5 x 0.35: 1 -8,6; 2 -8,5.5; 3 -8,5; 4 -8,4.5; 5 -8,4; 6 -8,3.5; 7 -8,3; 8 -8,2.5; 9 -8,2; 10 -8,1.5; 11 -8,1; 12 -8,0.5; 13 -8,0; 14 -8,-0.5; 15 -8,-1; 16 -8,-1.5; 17 -8,-2; 18 -8,-2.5; 19 -8,-3; 20 -8,-3.5; 21 -8,-4; 22 -8,-4.5; 23 -8,-5; 24 -8,-5.5; 25 -8,-6; 51 8,-6; 52 8,-5.5; 53 8,-5; 54 8,-4.5; 55 8,-4; 56 8,-3.5; 57 8,-3; 58 8,-2.5; 59 8,-2; 60 8,-1.5; 61 8,-1; 62 8,-0.5; 63 8,0; 64 8,0.5; 65 8,1; 66 8,1.5; 67 8,2; 68 8,2.5; 69 8,3; 70 8,3.5; 71 8,4; 72 8,4.5; 73 8,5; 74 8,5.5; 75 8,6 | smd 0.35 x 1.5: 26 -6,-8; 27 -5.5,-8; 28 -5,-8; 29 -4.5,-8; 30 -4,-8; 31 -3.5,-8; 32 -3,-8; 33 -2.5,-8; 34 -2,-8; 35 -1.5,-8; 36 -1,-8; 37 -0.5,-8; 38 0,-8; 39 0.5,-8; 40 1,-8; 41 1.5,-8; 42 2,-8; 43 2.5,-8; 44 3,-8; 45 3.5,-8; 46 4,-8; 47 4.5,-8; 48 5,-8; 49 5.5,-8; 50 6,-8; 76 6,8; 77 5.5,8; 78 5,8; 79 4.5,8; 80 4,8; 81 3.5,8; 82 3,8; 83 2.5,8; 84 2,8; 85 1.5,8; 86 1,8; 87 0.5,8; 88 0,8; 89 -0.5,8; 90 -1,8; 91 -1.5,8; 92 -2,8; 93 -2.5,8; 94 -3,8; 95 -3.5,8; 96 -4,8; 97 -4.5,8; 98 -5,8; 99 -5.5,8; 100 -6,8
32005-201 = smd 3.1 x 0.5: 1 3,1.6; 2 3,0.8; 3 3,0; 4 3,-0.8; 5 3,-1.6 | smd 2.5 x 2: M1 -3,-4.45; M2 -3,4.45 | smd 3.3 x 2: M3 2.9,4.45; M4 2.9,-4.45 | hole 0.9: 0,2.2; 0,-2.2

### Placement (x,y rotation side)
BAT  17.65,4.83 0 top
C1  24.54,39.17 270 top
C2  49.91,39.65 0 top
C3  23.85,53.16 90 top
C4  30.63,56.29 180 top
C5  49.5,58.14 90 top
C6  34.85,35.18 270 top
C7  25.27,53.21 90 top
C8  12.19,60.83 270 top
C9  48.51,3.56 270 top
C10  29.59,72.9 270 top
C11  62.2,62.28 270 top
C12  94.74,13.51 180 top
C13  28.75,62.59 90 top
C14  58.93,5.33 270 top
C15  60.81,57.48 270 top
C16  51,27.46 270 top
C17  9.98,40.79 90 top
C18  56.57,16.97 270 top
C19  33.68,16.43 270 top
C20  13.46,24.89 90 top
C21  23.39,13.87 0 top
C22  19.91,22.86 0 top
C23  31.62,23.14 180 top
C24  61.67,25.55 90 top
C25  67.18,33.93 90 top
C26  29.18,12.06 90 top
C29  97.54,42.67 90 top
C30  59.16,53.01 270 top
C31  27.94,40.26 270 top
C32  22.86,49.4 90 top
C33  29.59,40.26 270 top
C34  24.13,49.4 90 top
C35  47.24,36.7 270 top
C36  53.09,53.59 0 top
CAN_TRANS  9.91,35.76 180 top
EEPROM  54.13,57.58 0 top
H1  100.33,4.83 0 top
H2  5.08,4.83 0 top
H3  100.33,74.68 0 top
H4  5.08,74.68 0 top
IC1  20.4,62.53 90 top
IC2  42.49,22.71 180 top
IC3  55.55,25.45 0 top
JP2  65.05,42.8 270 top
JP4  38.86,33.53 0 top
JP5  28.45,4.7 270 top
JP6  3.91,35.23 270 top
JP7  38.71,65.33 90 top
JP8  34.34,65.28 90 top
JP9  41.4,33.53 0 top
JP10  70.66,73.96 270 top
JTAG-ETM  4.83,51.18 270 top
L1  27.41,50.77 270 top
L2  53.59,9.14 90 top
LED1  17.75,76.12 90 top
LED2  13,76.12 270 top
LED3  22.38,76.12 90 top
LED4  54.36,16.71 180 top
M1  99.52,27.3 90 bottom
M2  99.29,58.9 90 bottom
MPU9150  61.7,50.5 180 top
Q1  79.3,43.92 90 top
Q3  61.72,14.22 270 top
Q4  77.09,5.08 90 top
R1  33.91,20.32 270 top
R2  12.73,42.39 0 top
R3  15.37,69.47 0 top
R4  27.69,74.63 90 top
R5  25.83,72.95 270 top
R6  63.5,27.05 90 top
R7  66.37,25.68 270 top
R8  16.69,73.84 90 top
R10  63.7,32.18 90 top
R11  69.27,35.41 270 top
R12  63.47,22.2 90 top
R13  66.47,28.55 0 top
R14  61.47,29.59 0 top
R15  62.69,58.22 270 top
R16  69.8,67.06 270 top
R17  65.33,55.75 90 top
R18  66.75,66.04 270 top
R19  9.02,30.35 180 top
R20  64.8,66.07 90 top
R21  66.52,61.29 270 top
R22  64.69,61.32 90 top
R23  11.94,73.63 270 top
R24  90.7,74.57 270 top
R25  90.81,6.81 90 top
R26  59.28,56.64 270 top
R27  57.84,58.17 270 top
R28  59.18,14.22 270 top
R29  51.05,23.88 90 top
R30  49.02,26.06 270 top
R31  16.94,20.42 270 top
R32  23.32,11.91 180 top
R34  19.1,26.67 90 top
R35  29.08,26.8 180 top
R36  35.33,23.8 270 top
R37  32.28,20.29 270 top
R38  31.11,30.43 90 top
R39  29.39,30.43 270 top
R40  26.62,31.24 180 top
R41  21.31,73.61 90 top
R42  64.26,12.19 180 top
R43  52.48,15.09 90 top
R44  26.42,44.2 270 top
R45  14.2,64.49 90 top
R46  51.05,20.83 90 top
R47  48.77,15.75 270 top
RST  18.26,42.34 0 top
S1  5.03,20.42 0 top
TP1  48.64,28.96 0 top
TP2  61.47,22.35 0 top
TP3  58.24,63.17 0 top
TP4  43.94,30.23 0 top
TP5  62.61,66.93 0 top
TP6  55.88,13.84 0 top
TP7  27.86,35 0 top
U2  82.58,59.11 270 top
U3  22.56,16.76 0 top
U5  82.58,27.56 270 top
U7  67.79,17.2 180 top
U8  63.55,52.73 0 top
U$1  18.19,51.41 270 top
U$2  93.95,3.99 90 top
U$3  93.95,75.82 270 top
U$4  44.96,67.31 180 top
U$5  16.13,14.48 180 top
U$6  41.1,7.85 180 top
U$7  28.55,17.83 270 top
U$8  21.64,20.4 180 top
U$9  19.3,33.58 0 top
U$10  23.9,32 270 top
U$11  62.92,1.85 0 top
U$12  84.1,5.03 0 top
U$14  40.64,47.62 0 top
USER  36.09,75.77 180 top
X1  5.08,64.52 0 top

### Tracks (layer width: path | path; a pad name or v marks a point on that pad's centre or on a via)
+3V3  (via drill 0.38)  (6 unrouted)
  Top 0.305: 34.64,55.12 U$14.100 34.64,56.8 v34.54,56.9 | 34.64,55.12 34.64,51.66 34.11,51.12 U$14.6 31.57,51.12 31.24,50.8 31.24,49.02 31.64,48.62 U$14.11 35.81,48.62 v35.81,48.77 | L1.1 27.41,54.08 27.94,54.61 29.97,54.61 30.73,55.37 31.5,55.37 | 31.5,55.37 34.39,55.37 34.64,55.12 | U$14.19 34.72,44.62 v35.05,44.96 | C16.1 49.29,28.31 TP1.TP | C2.1 46.66,39.65 U$14.50 49.02,39.62 | U$14.75 49.78,53.62 49.78,54.94 | 59.18,57.59 R26.1 | R27.1 57.37,58.55 EEPROM.8 54.48,58.55 53.85,57.91 53.85,55.88 52.83,54.86 49.86,54.86 49.78,54.94 | U$14.28 35.64,38.18 v35.05,37.59 34.59,37.13 34.59,36.28 C6.1 | C4.1 31.48,55.39 31.5,55.37 | 49.78,54.94 49.78,57.01 C5.1 49.14,57.66 46.48,57.66 44.45,59.69 44.45,62.74 U$4.2
  Top 0.406: CAN_TRANS.3 11.35,36.4 9.4,38.35 9.4,39.36 9.53,39.49 | 9.14,38.98 9.08,39.04 | U$4.2 42.16,63.5 41.4,64.26 41.4,68.07 41.91,68.58 | 41.91,68.58 U$4.6 | 41.91,68.58 41.91,71.37 39.78,73.51 USER.1 USER.2 31.38,72.05 C10.2 | R26.1 59.97,57.49 C15.1 | 59.18,57.59 59.18,58.93 58.93,59.18 58,59.18 R27.1 | 9.91,39.87 C17.1 | 16,53.85 16,53.86 U$1.1 | U$1.4 20.19,53.85 | 23.62,52.32 23.84,52.32 C3.1
  Top 0.61: L1.1 26.77,52.36 C7.1 25.22,52.31 C3.1 23.85,52.07 | Q3.1 59.94,15.17 | 59.94,15.17 59.54,15.17 R28.1 | JP6.1 9.08,39.04 9.53,39.49 C17.1 11.24,39.94 11.68,40.39 11.68,42.2 R2.1 11.94,42.45 11.94,45.21 13.21,46.48 13.21,51.05 16,53.85 20.19,53.85 20.32,53.85 21.84,52.32 23.62,52.32 | 58.56,28.31 55.26,28.31 IC3.4 51.3,28.6 | 58.56,28.31 59.69,27.18 59.69,15.43 59.94,15.17 | 66.29,40.23 JP2.6 63.91,37.85 63.25,37.85 62.23,36.83 62.23,33.02 60.71,31.5 59.21,31.5 MPU9150.VCC 58.56,30.85 58.56,28.31 | C16.1 51.3,28.6 | 51.3,28.6 51.4,28.7 v55.37,28.7 | C2.1 49.06,38.06 49.53,37.59 v50.29,37.59
  Bottom 0.305: v34.54,56.9 34.54,58.67 32,61.21 32,63.5 32.51,64.01 43.18,64.01 U$4.2 | v50.29,37.59 v35.05,37.59 34.8,37.59 34.04,38.35 34.04,44.96 | 34.04,44.96 34.04,48.26 34.54,48.77 v35.81,48.77 | v35.05,44.96 34.04,44.96
  Bottom 0.61: JP6.1 3.91,42.32 2.54,43.69 2.54,55.63 3.81,56.9 JTAG-ETM.1 | v55.37,28.7 55.37,36.83 54.61,37.59 v50.29,37.59
+5V  (via drill 0.38, 0.6)
  Top 0.406: 15.75,63.5 16.51,63.5 16.52,63.51 IC1.20 15.76,63.51 15.75,63.5 | C8.1 12.48,61.98 v13.46,61.98 14.22,61.98 15.75,63.5 | R23.2 12.19,72.56 v12.19,70.36 | v65.28,33.03 65.28,37.08 66.29,38.1 67.56,38.1 68.07,38.61 68.07,46.23 66.8,47.5 v64.52,47.5 | 60.97,53.86 61.98,54.86 v62.99,54.86 62.69,55.17
  Top 0.61: LED4.A 56.51,17.76 C18.1 56.57,18.72 v57.91,20.07 57.91,22.24 IC3.3 | v65.28,33.03 65.87,33.03 | 66.06,16.54 65.79,16.26 | 65.79,16.26 65.79,12.19 | R42.1 65.79,12.19 | 65.79,12.19 67.82,12.19 71.12,8.89 71.12,3.95 U$11.3 | 65.79,16.26 65.53,16 62.99,16 60.96,18.03 v60.96,20.07
  Bottom 0.406: v13.46,61.98 13.46,69.09 v12.19,70.36 | v64.52,47.5 64.52,53.34 v62.99,54.86
  Bottom 0.61: v13.46,61.98 13.46,60.71 11.18,58.42 3.05,58.42 1.02,56.39 1.02,24.38 2.54,22.86 9.4,22.86 24.89,7.37 24.89,2.54 26.67,0.76 67.93,0.76 U$11.3 72.58,3.87 74.42,2.03 91.19,2.03 94.74,5.59 94.74,11.68 102.87,19.81 102.87,27.69 102.74,27.81 | M2.4 101.88,58.9 103.12,57.66 103.12,28.19 102.74,27.81 | 102.74,27.81 102.11,27.18 100.91,27.18 M1.4 100.84,27.25 | v57.91,20.07 60.71,20.07 | 60.71,20.07 v60.96,20.07 | 60.71,20.07 61.47,20.83 61.47,23.62 66.29,28.45 66.29,32.02 v65.28,33.03
+12V  (via drill 0.6)  (3 unrouted)
  Top 0.406: C23.2 30.65,23.11 29.97,23.11 29.54,22.68 U$7.2 29.54,18.47 29.97,18.03 | v76.2,14.73 76.45,14.73
  Top 0.61: 29.97,18.03 31.24,18.03 | 31.24,18.03 32.93,18.03 | 32.93,18.03 C19.1 33.68,17.37 33.02,18.03 32.93,18.03 | 31.24,18.03 31.24,12.95 32.51,11.68 34.72,11.68 U$6.5 | 47.75,13.61 R47.3 | 51.29,9.4 L2.1 51.82,8.87 | 48.51,9.4 48.26,9.4 | 47.62,11.43 R47.3 | U$6.1 45.14,11.43 | 47.33,13.46 R47.3 | IC2.11 42.42,26.93 42.42,23.88 45.03,21.26 IC2.3 45.03,16.33 R47.3 | 28.45,7.11 JP5.1 | C23.2 30.67,24.64 | 30.67,24.64 30.67,25.59 R35.1 | 30.68,24.65 30.67,24.64 | U2.12 73.46,55.12 70.61,55.12 v70.1,54.61 | U5.12 73.46,23.57 71.58,23.57 | 71.58,23.57 71.48,23.57 70.36,22.45 70.36,22.35 | 71.58,23.57 70.36,22.35 | 70.36,22.35 70.36,20.83 70.87,20.32 v71.37,20.32 | R36.1 35.33,26.9 34.8,27.43 32.01,27.43 R35.1 | R35.1 31.88,26.92 31.88,28.81 R38.1
  Top 0.813: 51.29,9.4 48.51,9.4 C9.1 | 48.26,9.4 47.62,10.04 47.62,11.43 45.14,11.43 | 51.82,8.87 51.82,3.05 53.59,1.27 72.64,1.27 74.68,3.3 74.68,14.22 | 74.68,14.22 74.68,14.48 v74.42,14.73 | 74.64,14.19 74.68,14.22 | v33.78,26.16 32.65,26.16 31.88,26.92 | v49.78,10.67 51.56,10.67
  Top 1.016: JP5.3 25.65,2.16 25.65,7.11 28.45,7.11
  Top 1.27: 76.45,14.73 77.72,13.46 85.09,13.46 86.61,11.94 | v78.74,44.2 88.9,44.2 90.42,42.67
  Top 2.184: v71.37,38.35 71.37,41.15 74.42,44.2 v78.74,44.2
  Top 2.54: v78.74,44.2 78.46,43.92 | v76.2,14.73 75.78,14.73
  Bottom 0.61: U$6.5 U$6.4 U$6.3 39.62,11.46
  Bottom 0.813: U$6.3 U$6.2 U$6.1 | v33.78,26.16 35.31,26.16 49.78,11.68 v49.78,10.67
  Bottom 1.016: JP5.1 38.99,7.24 39.62,7.87 39.62,11.46
  Bottom 2.184: v70.1,54.61 70.1,51.05 76.96,44.2 v78.74,44.2 | v76.2,14.73 72.39,14.73 71.37,15.75 v71.37,20.32 v71.37,38.35
  other vias: 72.64,14.73
BATT_IN
  Top 0.61: U3.3 17.78,16.76 16.89,17.65 16.89,19.52 R31.2
  Top 0.813: U$9.4 19.3,33.02 19.3,32.93 | 10.41,27.09 10.41,21.21 12.06,19.56 16.93,19.56 R31.2
  Top 1.27: S1.1 7,27.09 10.41,27.09 C20.+ 13.46,30.99 15.49,33.02 19.3,33.02
ESP8266_GPIO0
  Bottom 0.305: U$4.3 45.72,66.04 44.96,66.8 44.96,71.88 47.24,74.17 70.46,74.17 JP10.2
FTDI_RX  (via drill 0.38)
  Top 0.406: IC1.5 25.86,60.91 v26.92,61.98
  Bottom 0.406: v26.92,61.98 27.43,61.98 30.73,65.28 JP8.2
FTDI_TX
  Top 0.406: JP7.2 38.66,65.28 37.34,65.28 36.58,64.52 36.58,61.72 35.31,60.45 28.96,60.45 26.81,58.31 IC1.1
GND  (via drill 0.38)
  Top 0.406: IC1.7 25.63,62.21 27.18,63.75 28.43,63.75 C13.2
  Top 0.61: C24.2 63.2,26.5 R6.1
  Top 0.813: C20.- 18.8,22.69 C22.1 19.3,22.52 19.3,20.83 U$8.A
  other vias: 34.54,50.04 40.64,42.16 55.63,52.83 51.05,46.99 60.96,52.07 55.12,66.29 27.69,69.09 41.66,46.99 28.7,55.63 48.01,55.12 46.23,50.8 37.08,60.45
  pour Bottom: -1.27,81.03 107.95,81.03 107.95,-1.52 -1.27,-1.52
  pour Top: -1.27,81.03 107.95,81.03 107.95,-1.52 -1.27,-1.52
M1_INB
  Top 0.61: U7.4 63.93,17.86 63.25,18.54 63.25,21.12 R12.1
M1_OUTA  (via drill 0.76)
  Top 0.406: U5.30 85.85,34.56 85.85,29.21 | 85.85,29.21 91.67,29.21 U5.24 | 85.62,35.71 85.34,35.71 v85.34,35.31 | U5.SLUG2 85.34,31.72 v85.34,32.77 | 85.85,29.21 85.34,29.21 v85.34,30.23
  Top 0.61: U5.24 U5.25 91.82,29.56 91.82,29.08 97.48,29.08 M1.5 | U5.1 73.89,34.56 73.89,35.76 85.62,35.76 85.62,35.71 | 85.62,35.71 U5.SLUG2 | U5.30 91.69,34.56 91.69,35.71 85.62,35.71 | U$2.GA 93.25,0.98 93.47,0.76 95.76,0.76 96.27,1.27 96.27,4.13 U$2.RC 94.66,9.56 96.01,10.92 96.01,19.56 99.57,23.11 99.57,28.52 M1.5 | M1.5 98.68,29.84 | 98.3,29.9 M1.5
M1_OUTB  (via drill 0.76)
  Top 0.406: 86,20.55 85.6,20.55 v85.6,19.81 | U5.SLUG3 85.6,23.39 v85.6,22.35 | 85.62,26.04 85.6,26.04 v85.6,24.89
  Top 0.61: U5.21 U5.22 | U5.21 91.67,26.02 91.72,26.06 96.95,26.06 M1.1 | U5.21 91.67,26.03 91.67,26.04 85.62,26.04 U5.SLUG3 | U5.SLUG3 86,23.39 86,20.55 91.67,20.55 U5.16 91.69,20.57 93.98,20.57 94.74,19.81 94.74,11.68 90.81,7.75 R25.2 | U5.SLUG3 85.34,23.39 85.34,20.6 73.47,20.6 U5.15
M2_INB
  Top 0.406: U8.4 65.53,52.07 65.79,52.32 65.79,54.45 R17.1
M2_OUTA  (via drill 0.76)  (1 unrouted)
  Top 0.406: U$3.RC 93.25,72.61 93.73,72.14 | U$3.GA 96.01,76.21 96.01,72.64 95.5,72.14 93.73,72.14 | 93.73,72.14 93.73,60.81
  Top 0.61: U2.1 85.42,66.11 | 85.42,66.11 85.62,66.11 | 85.62,66.11 U2.SLUG2 | U2.30 85.62,66.11 | 85.42,66.11 85.42,60.78 91.67,60.78 U2.25 | U2.25 U2.24 | U2.25 91.69,61.11 91.69,60.81 93.73,60.81 97.38,60.81 M2.5
  Top 2.54: 85.42,66.11 85.09,66.11 v85.09,66.04
  Bottom 2.54: 98.04,65.53 98.04,66.8 83.57,66.8 83.57,61.47 v85.09,61.47 98.04,61.47 98.04,65.02 | 98.04,65.02 84.58,65.02 84.58,63.5 85.09,63.5 | 85.09,63.5 96.77,63.5 96.77,63.25 96.52,63.25 96.52,65.53 98.04,65.53 | 98.04,65.53 98.04,65.02 | 85.09,63.5 v85.09,63.75
M2_OUTB  (via drill 0.38, 0.76)
  Top 0.406: R24.2 90.7,71.86 v91.44,71.12
  Top 0.61: U2.21 97.28,57.11 M2.1 | U2.21 U2.22 | U2.21 91.67,57.58 88.27,57.58 U2.SLUG3 85.8,54.77 85.8,52.3 85.99,52.11 U2.16 U2.15
  Top 2.54: 85.8,52.3 84.84,52.3 v84.84,51.31 | 85.8,54.77 84.84,54.77 v84.84,53.59 | U2.SLUG3 84.84,54.94 v84.84,56.13
  Bottom 0.406: v91.44,71.12 97.28,71.12 102.11,66.29 102.11,60.96 101.35,60.2 99.82,60.2 99.31,59.69 99.31,57.66 M2.1
N$1
  Top 0.61: U5.10 69.75,25.56 67.25,23.05 R12.2
N$2  (1 unrouted)
  Top 0.305: U$14.21 28,43.62 27.94,43.69
  Top 0.406: C33.1 C31.1 27.94,43.69 26.67,43.69 arc90 26.42,43.43
N$3
  Top 0.305: U$14.12 32.63,48.13 30.1,48.13 29.59,48.64 28.45,48.64 27.05,47.24 21.92,47.24 U$1.3
N$5
  Top 0.406: R45.1 14.72,64.16 IC1.19 19.71,64.16 20.83,65.28 20.83,68.33 19.68,69.47 R3.2
N$6
  Top 0.406: R6.2 64.05,27.9 65.02,26.92 66.37,26.92 R7.1
  Top 0.61: U5.8 69.98,27.56 69.09,26.67 66.37,26.67 R7.1
N$7  (via drill 0.6, 0.76)  (2 unrouted)
  Top 0.61: U2.2 U2.3 73.66,64.29 73.66,64.52 73.91,64.77 78.99,64.77 v78.99,60.71 | U2.SLUG1 U2.23 | U2.14 U2.13 73.48,53.62 79.53,53.62 v79.02,54.1 v79.02,57.15
  Top 2.184: 84.32,46.23 v83.06,46.23
  Top 2.54: U2.SLUG1 v79.02,57.15
  Bottom 2.184: v83.06,46.23 78.99,50.29 v78.99,60.71 79.02,60.68 v79.02,57.15
N$8
  Top 0.61: U2.5 75.69,62.11 75.69,58.11 U2.9 73.46,58.09 69.11,58.09 68.14,59.07 R15.1
N$9
  Top 0.61: U5.9 75.95,26.56 75.95,30.56 U5.5 73.4,30.48 69.09,30.48 68.24,31.33 R10.1
N$10
  Top 0.61: U5.4 70.23,31.56 69.27,32.53 R11.2
N$11  (via drill 0.76)  (2 unrouted)
  Top 0.61: U5.14 U5.13 73.41,22.56 73.41,22.1 79.53,22.1 79.53,22.58 | 79.53,22.58 U5.SLUG1 | U5.SLUG1 U5.23 | U5.2 U5.3 73.66,32.56 73.66,33.02 79.53,33.02 U5.SLUG1 | U5.SLUG1 79.53,26.95 v78.99,26.42 | U5.SLUG1 79.53,29.44 v78.99,29.97 | 79.53,22.58 v78.99,23.11
  Top 1.27: 82.55,15.75 81.66,15.75 | 84.46,15.87 v84.58,15.75 87.88,15.75 88.39,15.24
  Top 2.184: v84.58,15.75 82.55,15.75
  Bottom 2.184: v84.58,15.75 81.03,15.75 78.99,17.78 v78.99,29.97
N$12
  Top 0.61: U2.4 71.01,63.11 69.85,64.26 69.85,66.16 R16.2
N$13  (via drill 0.6)  (1 unrouted)
  Top 0.61: U5.11 70.79,24.56 68.07,21.84 v66.29,21.84
  Top 2.184: v84.07,11.18 83.69,11.31
  Bottom 2.184: v66.29,21.84 66.29,14.22 69.34,11.18 v84.07,11.18
N$14
  Top 0.61: R13.2 73.47,28.55 U5.7
N$15
  Top 0.61: U2.7 72.23,60.11 69.09,63.25 67.31,63.25 66.8,63.75 66.8,65.14 R18.2
N$16
  Top 0.61: U2.10 65.83,57.11 R17.2
N$17
  Top 0.61: IC2.4 46.79,16.45 47.24,16 50.8,16 51.31,16.51 51.31,19.72 R46.1
N$18
  Top 0.61: JP6.2 4.01,36.4 CAN_TRANS.6 10.08,36.4 10.41,36.07 10.41,30.9 R19.1
N$19
  Top 0.61: R22.1 66.5,60.47 R21.2 66.53,60.45 68.58,60.45 69.93,59.11 U2.8
N$20
  Top 0.61: R46.2 R29.1
N$21
  Bottom 2.54: 85.34,56.39 83.82,56.39 83.82,50.55 98.04,50.55 98.04,56.39 85.34,56.39 | 85.34,56.39 85.34,52.32 96.52,52.32 96.52,54.61 86.36,54.61 86.36,54.36
N$22  (via drill 0.38)
  Top 0.406: v21.84,60.96 22.54,60.26 IC1.4 27.28,60.26 C13.1 | IC1.17 19.99,65.46 v20.07,65.53
  Bottom 0.406: v21.84,60.96 21.84,63.75 v20.07,65.53
N$23
  Top 0.813: L2.2 57.66,9.14 58.93,7.87 C14.1 63.19,6.66 U$11.1
N$24  (1 unrouted)
N$25
  Top 0.305: 16.69,76.11 LED1.C
  Top 0.61: 16.69,76.11 R8.2
N$26
  Top 0.406: IC1.23 IC1.22 21.32,62.21 22.61,63.5 22.61,69.6 21.34,70.87 15.49,70.87 14.22,72.14 14.22,75.95 LED2.C
N$27
  Bottom 2.54: 98.3,30.73 98.3,29.72 84.33,29.72 84.33,36.32 98.3,36.32 98.3,30.73 | 98.3,30.73 97.79,30.73 97.79,35.05 85.6,35.05 85.6,31.75 96.52,31.75 96.52,32.26 96.27,32.26 96.27,33.53 87.12,33.53 87.12,33.27
N$28
  Top 0.406: IC1.15 13.67,66.76 11.43,64.52 X1.3
N$30
  Top 0.813: BAT.POS 13.72,4.83
  Top 1.27: 13.72,4.83 9.91,8.64 9.91,15.54 S1.2
N$31
  Top 0.61: LED2.A 11.96,74.5 R23.1
N$32
  Top 0.406: U$3.GC 94.66,74.51 94.66,74.76 93.47,75.95 93.47,77.35 | 93.16,77.47 U$3.RA | R24.1 90.7,76.99 91.44,77.72 93.1,77.72
  Top 0.61: U$3.RA 93.22,77.53 | 93.47,77.35 U$3.RA | 93.1,77.72 U$3.RA
N$33
  Bottom 2.54: 86.11,24.64 84.33,24.64 84.33,18.54 98.3,18.54 98.3,19.81 | 86.11,24.64 98.3,24.64 98.3,24.38 98.3,19.81 | 86.11,24.64 86.11,20.32 97.03,20.32 97.03,22.86 88.14,22.86 88.14,21.34 98.04,21.34 98.04,19.81 98.3,19.81
N$34  (via drill 0.6)
  Top 0.61: Q3.3 63.41,13.63 R42.2 63.41,8.98 66.29,6.1 v67.31,6.1
  Bottom 0.61: v67.31,6.1 80.53,6.1 U$12.+
N$35
  Top 0.61: IC2.5 47.9,21.44 48.77,20.57 R47.2
N$36
  Top 0.305: 29.54,73.8 C10.1 | C10.1 29.59,77.09 30.73,78.23 32.64,78.23 USER.4 USER.3 | R5.1 27.66,73.8 R4.1 29.56,73.78 C10.1
N$37
  Top 0.61: LED3.C 21.33,74.48 R41.2
N$38
  Top 0.61: U$2.RA 94.74,2.33 94.74,3.56 93.25,5.04 U$2.GC 93.03,5.96 R25.1
N$40  (via drill 0.6)
  Top 0.61: IC2.1 42.49,16.43 v43.43,15.49 | v33.02,13.72 33.02,14.92 C19.2
  Bottom 0.61: v33.02,13.72 34.8,15.49 v43.43,15.49 43.69,15.49 46.23,12.95 46.23,6.1 44.91,4.78 U$6.10
N$41
  Top 0.61: IC2.8 46.83,25.21 R30.2 49.02,22.91 48.82,22.71 IC2.6
N$42
  Top 0.61: IC2.20 41.22,15.67 43.69,13.21 43.69,5.36 U$6.9
N$43
  Top 0.61: IC2.19 39.95,14.15 41.15,12.95 41.15,5.36 U$6.8
N$44
  Top 0.61: IC2.18 38.19,13.11 38.61,12.7 38.61,5.36 U$6.7
N$45
  Top 0.61: U$6.6 36.07,5.36 36.07,20.57 36.93,21.44 IC2.17
N$46
  Top 0.61: U$8.C 23.62,20.32 23.62,18.8 22.53,17.7 U3.1 18.87,17.7 18.29,18.29 18.29,20.83 17.91,21.21 17,21.21 R31.1
N$47
  Top 0.61: U$9.1 R34.2
N$48
  Top 0.406: U$7.5 U$7.6
  Top 0.61: U3.2 22.1,15.82 | 22.1,15.82 24.97,15.82 26.92,17.78 26.92,19.86 U$7.6 | C21.1 22.61,13.87 | R32.2 22.54,11.91 C21.1 | C21.1 22.1,13.87 22.1,15.82
N$49  (via drill 0.6)
  Top 0.406: U$7.4 28.19,19.88 v28.19,17.53
  Top 0.61: C22.2 v20.86,24.38 20.86,24.86 20.07,25.65 19.27,25.65 R34.1
  Bottom 0.61: v28.19,17.53 25.15,17.53 20.83,21.84 20.83,24.35 v20.86,24.38
N$50
  Top 0.406: U$7.3 28.89,20.39 27.69,21.59
  Top 0.61: 25.57,27.51 R35.2 27.69,25.39 27.69,21.59
  Top 0.813: 26.16,26.68 R35.2
  Top 1.27: U$9.3 25.57,27.51
N$51
  Top 0.406: U$7.12 30.19,14.02 C26.2
N$52
  Top 0.406: U$7.1 30.19,20.53 30.73,21.08
  Top 0.61: R36.2 35.31,22.92 35.31,22.1 34.38,21.17 R1.1 33.88,21.14 R37.1 32.22,21.08 30.73,21.08
  Top 0.813: 32.28,21.08 R37.1
N$53  (via drill 0.38)
  Top 0.305: U$14.22 31.19,43.12 30.73,42.67 30.73,38.1 30.48,37.85 26.92,37.85 26.16,38.61 26.16,40.89 24.13,42.93 v24.13,45.97 25.49,45.97 R44.1 | 26.16,49.53 25.91,49.28 v25.91,48.39
  Top 0.406: L1.2 27.11,49.53 26.16,49.53 25.44,50.25 C34.2 C32.2
  Bottom 0.305: v25.91,48.39 24.13,46.61 v24.13,45.97
N$54
  Top 0.61: R38.2 R39.1 29.35,31.24 R40.1
N$58
  Top 0.61: R43.2 52.75,15.66 LED4.C
N$59
  Top 0.305: U$14.49 46.14,37.93 46.48,37.59 47.18,37.59 C35.1
N$60
  Top 0.406: 81.28,75.95 84.33,75.95 | 82.3,76.96 81.28,75.95 | 81.28,75.95 82.3,74.93
N$61
  Top 0.61: CAN_TRANS.7 8.56,35.13 9.14,34.54 9.14,32.51 8.13,31.5 8.13,30.39 R19.2 8.04,30.48 6.1,30.48 5.16,31.42 JP6.4
N$63
  Top 0.406: 84.33,72.14 84.33,75.18 | 83.31,73.15 84.33,72.14 | 84.33,72.14 85.34,73.15
N$64
  Top 0.406: IC1.16 18.1,66.11 18.54,66.55 18.54,67.56 18.29,67.82 13.21,67.82 10.71,65.32 X1.2
N$66
  Top 0.305: U$14.73 50.09,52.62 50.55,53.09 51.63,53.09 C36.1
NRST  (via drill 0.38)
  Top 0.305: U$14.14 29.84,47.12 v29.21,47.75 | v11.68,46.74 11.18,47.24 11.18,51.31 v10.67,51.82
  Top 0.406: R2.2 14.45,42.39 14.99,42.93 14.99,44.58 RST.1 | RST.2 21.61,44.7 22.1,44.7 22.61,44.2 22.61,42.67 24.28,41 24.28,40.27 C1.1
  Bottom 0.305: JTAG-ETM.10 v10.67,51.82 | v29.21,47.75 28.19,47.75 25.15,44.7 21.51,44.7 | v11.68,46.74 14.99,46.74 | 14.99,46.74 21.59,46.74 21.51,46.66 21.51,44.7 | RST.1 15.01,46.71 14.99,46.74 | RST.2 21.51,44.7
PA0  (via drill 0.38)
  Top 0.305: U$14.23 31.45,42.62 31.24,42.42 31.24,40.64 31.75,40.13 31.75,37.85 31.24,37.34 26.16,37.34 25.4,36.58 23.88,36.58 23.11,37.34 23.11,38.1 22.35,38.86 19.3,38.86 18.54,39.62 v18.54,42.42 | v5.84,43.69 1.78,43.69 0.76,44.7 0.76,57.15 1.78,58.17 9.91,58.17 10.67,58.93 v10.67,62.48 | R4.2 25.87,75.47 v25.4,75.95
  Bottom 0.305: v18.54,42.42 7.11,42.42 v5.84,43.69 | v10.67,62.48 10.67,75.18 11.94,76.45 24.89,76.45 v25.4,75.95
PA1  (via drill 0.38)
  Top 0.305: U$14.24 34.25,42.12 v35.81,43.69
  Bottom 0.406: MPU9150.INT 40.59,49.23 39.88,48.51 37.59,48.51 35.81,46.74 v35.81,43.69
PA2  (via drill 0.38)
  Top 0.305: v56.39,30.23 TP4.TP 35.56,30.23 32.64,33.15 U$14.25
  Top 0.61: 65.6,28.57 R13.1 65.62,28.61 64.77,29.46 v63.75,29.46 62.45,29.46 R14.2
  Bottom 0.305: v56.39,30.23 61.47,30.23 62.23,29.46 v63.75,29.46
PA3  (via drill 0.38)
  Top 0.305: U$14.26 34.65,41.45 37.39,44.2 v46.23,44.2 | v51.56,44.96 54.86,48.26 60.2,48.26 v62.74,50.8 | v60.96,67.06 62.48,67.06 TP5.TP
  Top 0.406: R18.1 64.82,66.89 R20.2 62.62,66.92 TP5.TP
  Bottom 0.305: v46.23,44.2 50.8,44.2 v51.56,44.96 | v62.74,50.8 62.74,51.82 60.45,54.1 58.93,54.1 58.17,54.86 58.17,66.04 59.18,67.06 v60.96,67.06
PA4
  Top 0.305: U$14.29 36.14,34.73 37.34,33.53 JP4.1
PA5
  Top 0.305: U$14.30 36.64,36.26 37.59,35.31 39.62,35.31 JP9.1
PA6  (via drill 0.38)
  Top 0.305: U$14.31 37.13,42.06 38.51,43.43 v46.74,43.43 | v52.58,44.96 54.36,46.74 56.64,46.74 57.66,47.75 60.71,47.75 v63.75,50.8
  Top 0.61: R22.2 63.63,63.23 C11.1 62.14,63.17 v59.69,63.17 TP3.TP
  Bottom 0.305: v46.74,43.43 51.05,43.43 v52.58,44.96 | v63.75,50.8 63.75,52.07 61.21,54.61 61.21,62.66 60.71,63.17 v59.69,63.17
PA7  (via drill 0.38)
  Top 0.305: TP6.TP 56.52,13.84 arc-90 56.64,13.72 56.9,13.72 arc-90 57.4,13.21 | U$14.32 37.64,37.8 38.86,36.58 40.13,36.58 v40.89,35.81
  Top 0.61: Q3.2 59.28,13.27 | 59.28,13.27 R28.2 | 59.28,13.27 59.22,13.21 v57.91,13.21 57.4,13.21 56.77,13.84 TP6.TP
  Bottom 0.305: v57.91,13.21 54.1,13.21 49.53,17.78 49.53,28.7 42.42,35.81 v40.89,35.81
PA8
  Top 0.305: U$14.67 50.9,49.62 52.32,51.05 55.88,51.05 56.9,52.07 56.9,53.59 54.86,55.63 54.86,57.15 54.97,57.25 EEPROM.6 57.84,57.25 R27.2
PA9  (via drill 0.38)
  Top 0.305: U$14.68 50.63,50.12 52.07,51.56 53.85,51.56 v54.36,52.07
  Bottom 0.305: v54.36,52.07 54.36,61.72 52.58,63.5 U$4.1
  Bottom 0.406: JP7.3 40.08,67.87 41.15,66.8 41.15,65.79 42.16,64.77 44.96,64.77 U$4.1
PA10  (via drill 0.38)
  Top 0.305: U$14.69 50.37,50.62 52.07,52.32 v52.83,52.32 | v51.56,62.48 51.56,66.29 48.01,69.85 44.96,69.85 U$4.8
  Bottom 0.305: v52.83,52.32 52.83,61.21 v51.56,62.48
  Bottom 0.406: JP8.3 34.34,69.9 35.56,71.12 U$4.8
PA13  (via drill 0.38)
  Top 0.305: U$14.72 50.74,52.12 v50.55,52.07
  Bottom 0.305: v50.55,52.07 35.81,52.07 29.72,58.17 14.48,58.17 13.21,56.9 JTAG-ETM.2
PA14  (via drill 0.38)
  Top 0.305: U$14.76 46.64,53.5 44.2,51.05 v44.2,50.8
  Bottom 0.305: v44.2,50.8 36.32,50.8 29.46,57.66 14.73,57.66 12.7,55.63 JTAG-ETM.4
PB3  (via drill 0.38)
  Top 0.305: v39.12,50.04 39.12,52.83 40.13,53.85 U$14.89
  Bottom 0.305: JTAG-ETM.6 12.45,54.36 14.99,56.9 29.46,56.9 36.32,50.04 v39.12,50.04
PB4  (via drill 0.38)
  Top 0.305: U$14.90 39.64,57.42 v40.39,58.17
  Top 0.406: M2.6 102.64,61.44 103.63,60.45 103.63,53.34 98.55,48.26 62.99,48.26 v62.74,48.51
  Bottom 0.305: v40.39,58.17 46.48,58.17 51.31,53.34 51.31,51.31 52.07,50.55 60.71,50.55 v62.74,48.51
PB5  (via drill 0.38)
  Top 0.305: U$14.91 39.14,58.44 v39.88,59.18
  Top 0.406: M2.2 100.56,52.05 97.54,49.02 64.01,49.02 v63.5,49.53
  Bottom 0.305: v63.5,49.53 62.99,49.53 61.47,51.05 53.09,51.05 52.07,52.07 52.07,54.36 46.99,59.44 40.13,59.44 v39.88,59.18
PB6  (via drill 0.38)
  Top 0.305: U$14.92 38.64,53.12 37.59,52.07 37.59,47.5 v39.12,45.97
  Bottom 0.406: M1.6 100.84,29.9 100.84,37.34 99.57,38.61 74.17,38.61 71.37,41.4 62.48,41.4 60.96,42.93 57.15,42.93 54.1,45.97 v39.12,45.97
PB7  (via drill 0.38)
  Top 0.305: U$14.93 38.14,53.38 37.08,52.32 v37.08,45.21
  Top 0.406: M1.2 101.98,24.77 103.12,25.91 103.12,37.08 v101.85,38.35
  Bottom 0.406: v37.08,45.21 37.08,46.48 38.1,47.5 40.64,47.5 41.15,48.01 54.86,48.01 57.4,45.47 60.71,45.47 61.98,44.2 67.06,44.2 68.83,42.42 71.63,42.42 74.42,39.62 100.58,39.62 v101.85,38.35
PB8  (via drill 0.6)
  Top 0.305: U$14.95 37.14,57.6 35.81,58.93 29.46,58.93 26.92,56.39 9.65,56.39 8.64,55.37 8.64,43.94 6.35,41.66 v5.84,41.66 | CAN_TRANS.4 12.37,38.68 12.19,38.86 v10.92,38.86
  Bottom 0.305: v10.92,38.86 10.92,39.88 9.14,41.66 v5.84,41.66
PB9  (via drill 0.6)
  Top 0.305: U$14.96 36.64,57.34 35.56,58.42 29.72,58.42 27.18,55.88 12.7,55.88 9.65,52.83 9.65,43.18 7.62,41.15 v7.62,40.64
  Top 0.406: CAN_TRANS.1 13.79,33.86 v14.73,34.8
  Bottom 0.305: v14.73,34.8 9.65,34.8 7.62,36.83 v7.62,40.64
PB10
  Top 0.305: MPU9150.SCL 59.12,36.58 57.15,36.58 52.83,32.26 46.74,32.26 44.45,34.54 44.45,37.85 45.14,38.54 U$14.47
PB11
  Top 0.305: U$14.48 45.64,34.88 46.48,34.04 51.31,34.04 56.39,39.12 59.12,39.12 MPU9150.SDA
PB12
  Top 0.305: U$14.51 55.66,41.62 57.15,40.13 63.65,40.13 JP2.5
PB13
  Top 0.305: U$14.52 53.81,42.12 54.61,42.93 60.45,42.93 61.98,41.4 64.92,41.4 JP2.4
PB14
  Top 0.305: U$14.53 52.02,42.62 54.61,45.21 61.37,45.21 JP2.3
PB15
  Top 0.305: U$14.54 51.76,43.12 54.36,45.72 63.4,45.72 JP2.1
PC0  (via drill 0.38)
  Top 0.305: U$14.15 28.34,46.62 v28.19,46.48
  Top 0.406: v27.94,36.58 27.86,36.5 TP7.TP 27.81,35.05 25.65,35.05 | 24.03,33.02 U$10.C 23.88,33.93 23.88,34.54 24.38,35.05 25.65,35.05 | R40.2 25.77,34.94 25.65,35.05
  Bottom 0.406: v27.94,36.58 27.94,46.23 v28.19,46.48
PC2  (via drill 0.38)
  Top 0.305: U$14.17 29.37,45.62 v29.21,45.47
  Top 0.406: 61.21,24.64 61.47,24.64 63.75,24.64 v64.01,24.38 64.23,24.6 66.14,24.6 R7.2
  Top 0.61: TP2.TP 61.47,24.4 | 61.47,24.4 C24.1 | 61.47,24.4 61.47,24.64
  Bottom 0.406: v29.21,45.47 29.21,34.04 51.82,11.43 58.17,11.43 63.25,16.51 63.25,21.59 64.01,22.35 v64.01,24.38
PC6  (via drill 0.38)
  Top 0.305: U$14.63 42.8,47.62 41.66,48.77 v41.66,53.09
  Bottom 0.305: v41.66,53.09 38.86,53.09 36.32,55.63 36.32,59.18 34.29,61.21 34.29,62.69 JP8.1
PC7  (via drill 0.38)
  Top 0.305: U$14.64 43.82,48.12 42.93,49.02 v42.93,53.09
  Bottom 0.305: v42.93,53.09 42.93,53.59 42.16,54.36 40.89,54.36 38.35,56.9 38.35,62.43 JP7.1
PC9
  Top 0.305: U$14.66 51.66,49.12 53.09,50.55 56.13,50.55 57.66,52.07 57.66,55.63 | EEPROM.5 56.19,56.08 56.64,55.63 57.66,55.63 | 57.66,55.63 59.12,55.63 R26.2
PD11  (via drill 0.38, 0.6)
  Top 0.305: U$14.58 45.72,45.12 v45.72,45.21
  Top 0.406: U7.2 70.03,17.2 70.36,17.53 70.36,18.8 69.85,19.3 v68.58,19.3 | 45.81,45.12 v45.72,45.21
  Top 0.61: v66.8,36.58 68.95,36.58 R11.1
  Bottom 0.406: v66.8,36.58 62.48,36.58 61.21,37.85 56.64,37.85 54.61,39.88 47.24,39.88 45.47,41.66 45.47,44.96 v45.72,45.21
  Bottom 0.61: v68.58,19.3 68.58,34.8 v66.8,36.58
PD12  (via drill 0.38)
  Top 0.305: v64.01,56.64 64.01,54.61 63.5,54.1 63.5,53.09 63.14,52.73 U8.2 61.57,52.73 61.21,53.09 60.45,53.09 60.2,52.83 60.2,50.8 59.94,50.55 58.42,50.55 57.4,49.53 55.37,49.53 51.47,45.62 U$14.59
  Top 0.406: v66.8,68.33 69.38,68.33 R16.1
  Bottom 0.406: v64.01,56.64 64.01,65.53 v66.8,68.33
PE0  (via drill 0.38, 0.6)
  Top 0.305: U$14.97 36.14,54.28 v36.83,53.59 | v23.37,73.91 23.43,73.97
  Top 0.406: 23.43,73.97 LED3.A
  Bottom 0.406: v36.83,53.59 36.58,53.59 33.78,56.39 33.78,58.17 32.26,59.69 25.15,59.69 24.13,60.71 24.13,70.1 23.37,70.87 v23.37,73.91
PE1  (via drill 0.38, 0.6)
  Top 0.305: U$14.98 35.64,57.32 35.31,57.66 v32.77,57.66
  Top 0.406: v18.8,74.42 v18.8,74.43 LED1.A
  Bottom 0.406: v18.8,74.42 18.8,74.17 23.11,69.85 23.11,60.71 24.89,58.93 31.5,58.93 v32.77,57.66
PE2  (via drill 0.38)
  Top 0.305: U$14.1 28.99,53.62 v28.96,53.59
  Bottom 0.305: JTAG-ETM.12 11.18,50.55 14.22,53.59 v28.96,53.59
PE3  (via drill 0.38)
  Top 0.305: U$14.2 29.5,53.12 29.21,52.83 v28.45,52.83
  Bottom 0.305: JTAG-ETM.14 10.67,49.28 14.22,52.83 v28.45,52.83
PE4  (via drill 0.38)
  Top 0.305: U$14.3 30.27,52.62 v29.97,52.32
  Bottom 0.305: JTAG-ETM.16 10.16,48.01 14.22,52.07 29.72,52.07 v29.97,52.32
PE5  (via drill 0.38)
  Top 0.305: v30.23,51.56 30.79,52.12 U$14.4
  Bottom 0.305: JTAG-ETM.18 9.91,46.74 14.73,51.56 v30.23,51.56
PE6  (via drill 0.38)
  Top 0.305: v29.21,50.29 29.97,50.29 31.3,51.62 U$14.5
  Bottom 0.305: JTAG-ETM.20 9.4,45.47 14.22,50.29 v29.21,50.29
USB_5V
  Top 0.406: X1.1 10.24,66.12 13.72,69.6 14.39,69.6 R3.1
UV
  Top 0.406: U$7.8 27.59,13.36 26.16,11.94 24.19,11.94 R32.1
  Top 0.61: U$5.2 19.05,14.48 19.05,10.79 19.81,10.03 23.5,10.03 24.26,10.79 24.26,11.82 R32.1
(copper drawn outside any net)
  shapes: Top area x23

### Text on the board
Top: Ser rx/tx | usr | err | User | X | Y | M2 | ESP8266 | STM32 | JTAG | Reset | 3.3V | CL | CH | PWR | M1 | +12V | FULL BATTERY
Bottom: freBOT-V2/1